# Altium project Mixed Signal Board Project.PrjPcb (part 1 of 2)
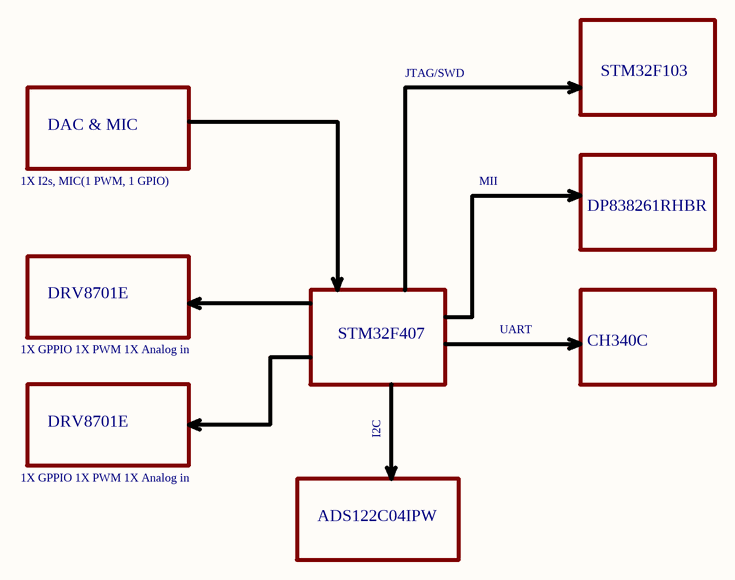
[diagram p0: [1]- Schematic Block.SchDoc]
11 sheets, 189 parts. Net scope: flat (ports and power ports of the same name join across sheets).
Board file: Mixed Signal Board Project.PcbDoc
Sheets:
  [1]- Schematic Block.SchDoc
  [2]- Power Budget.SchDoc
  [3]- STM32F103 Debugger.SchDoc
  [4]- Ethernet PHY.SchDoc
  [5]- Motor Driver Schematic.SchDoc
  [6]-CH340C.SchDoc
  [7]- ADC Chip.SchDoc
  [8]-DAC and MIC.SchDoc
  [9]-STM32F407 Controller.SchDoc
  [10]-Motor Driver-2.SchDoc
  [11]- Power Input and Regulators.SchDoc

## Sheet [1]- Schematic Block.SchDoc
size A4; DocumentNumber: 1; SheetNumber: 1; SheetTotal: 11

### Notes on the sheet
- DAC & MIC
- JTAG/SWD
- STM32F103
- 1X I2s, MIC(1 PWM, 1 GPIO)
- MII
- DP838261RHBR
- DRV8701E
- STM32F407
- UART
- 1X GPPIO 1X PWM 1X Analog in
- CH340C
- I2C
- ADS122C04IPW

## Sheet [2]- Power Budget.SchDoc
size A4; DocumentNumber: 2; SheetNumber: 2; SheetTotal: 11
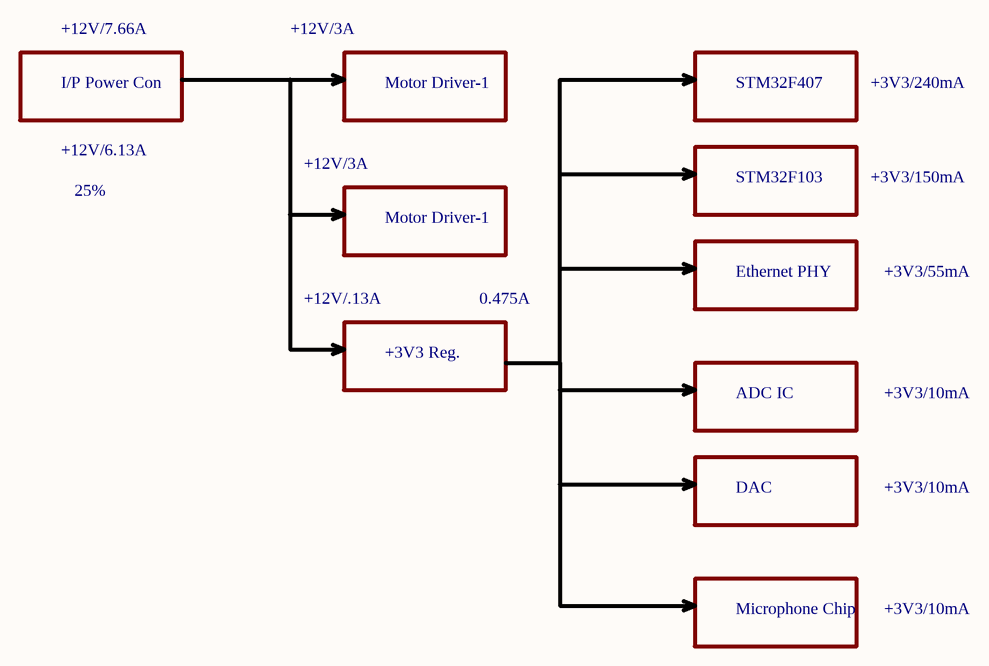
[diagram p1: [2]- Power Budget.SchDoc]

### Notes on the sheet
- +12V/7.66A
- +12V/3A
- I/P Power Con
- Motor Driver-1
- STM32F407
- +3V3/240mA
- +12V/6.13A
- 25%
- STM32F103
- +3V3/150mA
- Ethernet PHY
- +3V3/55mA
- +12V/.13A
- 0.475A
- +3V3 Reg.
- ADC IC
- +3V3/10mA
- DAC
- Microphone Chip

## Sheet [3]- STM32F103 Debugger.SchDoc
size A4; DocumentNumber: 3; SheetNumber: 3; SheetTotal: 11
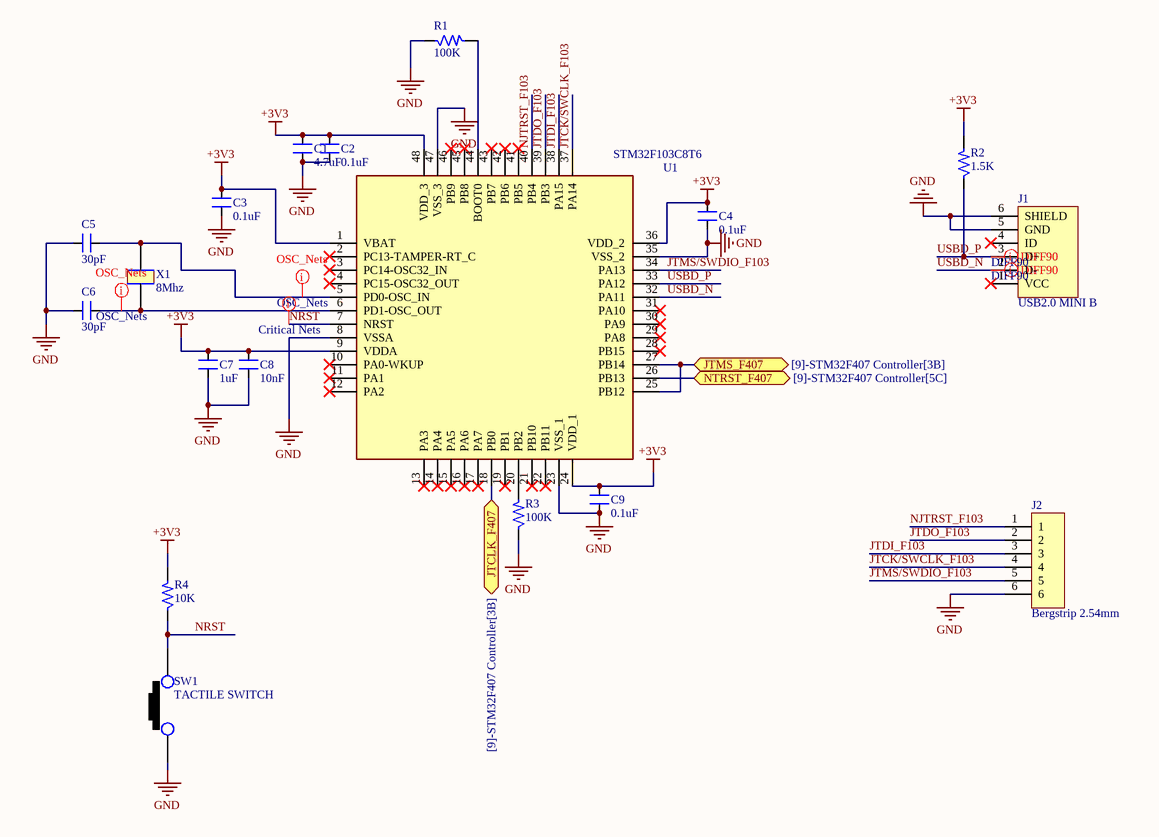
[diagram p2: [3]- STM32F103 Debugger.SchDoc]

### Parts
C1  4.7uF  [CAP_0805]
C2  0.1uF  [CAP_0805]
C3  0.1uF  [CAP_0805]
C4  0.1uF  [CAP_0805]
C5  30pF  [CAP_0805]
C6  30pF  [CAP_0805]
C7  1uF  [CAP_0805]
C8  10nF  [CAP_0805]
C9  0.1uF  [CAP_0805]
J1  USB2.0 MINI B  [CON_690-005-299-043]
J2  Bergstrip 2.54mm  [CON6_100_59D78_TH_ST]
R1  100K  [RES_0603]
R2  1.5K  [RES_0805]
R3  100K  [RES_0603]
R4  10K  [RES_0603]
SW1  TACTILE SWITCH  [SW_342_SMD]
U1  STM32F103C8T6  [LQFP-48_19.6_393_58X11_SMD]
X1  8Mhz  [XTAL_314_240X47_SMD]

### Ports
JTCLK_F407 (bidir, see [9]-STM32F407 Controller[3B]), JTMS_F407 (bidir, see [9]-STM32F407 Controller[3B]), NTRST_F407 (bidir, see [9]-STM32F407 Controller[5C])

### Nets
+3V3: C1.2 C2.1 C3.2 C4.1 C7.2 C8.2 C9.2 R2.2 R4.2 U1.1(VBAT) U1.9(VDDA) U1.24(VDD_1) U1.36(VDD_2) U1.48(VDD_3)
GND: C1.1 C2.2 C3.1 C4.2 C5.1 C6.1 C7.1 C8.1 C9.1 J1.5(GND) J1.6(SHIELD) J2.6 R1.1 R3.1 SW1.1 U1.8(VSSA) U1.23(VSS_1) U1.35(VSS_2) U1.47(VSS_3)
JTCK/SWCLK_F103: J2.4 U1.37(PA14)
JTCLK_F407: U1.18(PB0) ; port JTCLK_F407
JTDI_F103: J2.3 U1.38(PA15)
JTDO_F103: J2.2 U1.39(PB3)
JTMS/SWDIO_F103: J2.5 U1.34(PA13)
JTMS_F407: U1.25(PB12) U1.27(PB14) ; port JTMS_F407
NJTRST_F103: J2.1 U1.40(PB4)
NRST: R4.1 SW1.2 U1.7(NRST)
NTRST_F407: U1.26(PB13) ; port NTRST_F407
USBD_N: J1.2(D-) U1.32(PA11)
USBD_P: J1.3(D+) R2.1 U1.33(PA12)
NetC5_2: C5.2 U1.5(PD0-OSC_IN) X1.2
NetC6_2: C6.2 U1.6(PD1-OSC_OUT) X1.1
NetR1_2: R1.2 U1.44(BOOT0)
NetR3_2: R3.2 U1.20(PB2)

Not connected (* = marked no-connect by the designer): J1 1(VCC)* 4(ID)*; U1 2(PC13-TAMPER-RT_C)* 3(PC14-OSC32_IN)* 4(PC15-OSC32_OUT)* 10(PA0-WKUP)* 11(PA1)* 12(PA2)* 13(PA3)* 14(PA4)* 15(PA5)* 16(PA6)* 17(PA7)* 19(PB1)* 21(PB10)* 22(PB11)* 28(PB15)* 29(PA8)* 30(PA9)* 31(PA10)* 41(PB5)* 42(PB6)* 43(PB7)* 45(PB8)* 46(PB9)*

### Layout directives
differential pair; differential pair class DIFF90: USBD_N, USBD_P
net class OSC_Nets: NetC5_2, NetC6_2
net class Critical Nets: NRST

### Library data of the parts
C1 = CAP_4.7uF-50V-10%-0805: 4.7µF ±10% 50V Ceramic Capacitor X5R 0805 (2012 Metric); Manufacturer: Yageo; Manufacturer Part Number: GRM21BR61H475KE51L; Alternate Part Number-1: NA; Case/Package: 0805; Supplier-1: SIRICOM; Supplier Part Number-1: CL21A475KBQNNNE
C2-C4 C9 = CAP_0.1uF-50V-10%-0805: 0.1µF ±10% 50V Ceramic Capacitor X7R 0805 (2012 Metric); Manufacturer: Samsung; Manufacturer Part Number: CL21B104KBCNNNC; Alternate Part Number-1: NA; Case/Package: 0805; Supplier-1: SIRICOM; Supplier Part Number-1: 0805B104K500CT
C5 C6 = CAP_30pF-50V-10%-0805: ±10% 50V Ceramic Capacitor C0G, NP0 0805 (2012 Metric); Manufacturer Part Number: C0805C300K5GAC7800; Manufacturer: KEMET; Alternate Part Number: NA; Case/Package: 0805; Supplier-1: Digikey; Supplier Part Number-1: 399-17443-1-ND - Cut Tape (CT)
C7 = CAP_1uF-50V-5%-0805: 1µF ±5% 50V Ceramic Capacitor X7R 0805 (2012 Metric); Manufacturer: Samsung; Manufacturer Part Number: CC0805JKX7R9BB105; Alternate Part Number-1: 0805F105M500NT; Case/Package: 0805; Supplier-1: SIRICOM; Supplier Part Number-1: CL21B105KBFNNNE
C8 = CAP_10nF-50V-10%-0805: 10000pF ±10% 50V Ceramic Capacitor X7R 0805 (2012 Metric); Manufacturer: Samsung; Manufacturer Part Number: C0805C103K5RECAUTO; Alternate Part Number-1: GRM2195C1H103JA01D; Case/Package: 0805; Supplier-1: SIRICOM; Supplier Part Number-1: 0805B103K500CT
J1 = CON_USB2.0-MINIB-SMD: USB - mini B USB 2.0 Receptacle Connector 5 Position Surface Mount, Right Angle; Manufacturer: EDAC; Manufacturer Part Number: 690-005-299-043; Alternate Part Number-1: NA; Case/Package: USB-MINI-B; Supplier-1: LCSC; Supplier Part Number-1: C105424
J2 = CON-BS-SKT_6X1-100-ST-TH: 6 Pins, 1 Row 2.54mm Pitch, Straight bergstrip, Female; Manufacturer: Molex; Alternate Part Number-1: NA; Manufacturer Part Number: 22-10-2061; Case/Package: TH-CON; Supplier-1: SP ROAD; Supplier Part Number-1: NA
R1 R3 = RES_100K-0.1W-1%-0603: 100 kOhms ±1% 0.1W, 1/10W Chip Resistor 0603 (1608 Metric) Automotive AEC-Q200 Thick Film; Manufacturer: Stackpole Electronics; Manufacturer Part Number: RMCF0603FT100K; Alternate Part Number-1: NA; Case/Package: 0603; Supplier-1: Arrow; Supplier Part Number-1: RMCF0603FT100K
R2 = RES_1.5K-0.125W-1%-0805: 1.5 kOhms ±1% 0.125W, 1/8W Chip Resistor 0805 (2012 Metric) Thick Film; Manufacturer: TE Connectivity Passive Product; Manufacturer Part Number: CRG0805F1K5; Alternate Part Number-1: NA; Case/Package: 0805; Supplier-1: SIRICOM; Supplier Part Number-1: NA
R4 = RES_10K-0.1W-1%-0603: 10 kOhms ±1% 0.1W, 1/10W Chip Resistor 0603 (1608 Metric) Automotive AEC-Q200 Thick Film; Manufacturer: Walsin; Manufacturer Part Number: WR06X1002FTL; Alternate Part Number-1: 0603WAJ0103T5E; Case/Package: 0603; Supplier-1: SIRICOM; Supplier Part Number-1: WR06X1002FTL
SW1 = SW1_RS-282G05A3-SMRT-SMD: Tactile Switch SPST-NO Top Actuated Surface Mount; Manufacturer: ITT C&K; Alternate Part Number-1: NA; Manufacturer Part Number: RS-282G05A3-SMRT; Case/Package: SMD; Supplier-1: SP ROAD; Supplier Part Number-1: RS-282G05A3-SMRT
U1 = IC_STM32F103C8T6: ARM® Cortex®-M3 STM32F1 Microcontroller IC 32-Bit 72MHz 64KB (64K x 8) FLASH 48-LQFP (7x7); Manufacturer: STMicroelectronics; Alternate Part Number-1: NA; Manufacturer Part Number: STM32F103C8T6; Case/Package: LQFP48; Supplier-1: LCSC; Supplier Part Number-1: STM32F103C8T6
X1 = XTAL_8MHZ-ECS-80-32-5PX-SMD: 8MHz ±30ppm Crystal 32pF 60 Ohms HC-49/US; Manufacturer: Fox Electronics; Manufacturer Part Number: ECS-80-32-5PX-TR; Alternate Part Number-1: NA; Case/Package: SMD/SMT; Supplier-1: SP ROAD; Supplier Part Number-1: ECS-80-32-5PX-TR

## Sheet [4]- Ethernet PHY.SchDoc
size A4; DocumentNumber: 4; SheetNumber: 4; SheetTotal: 11
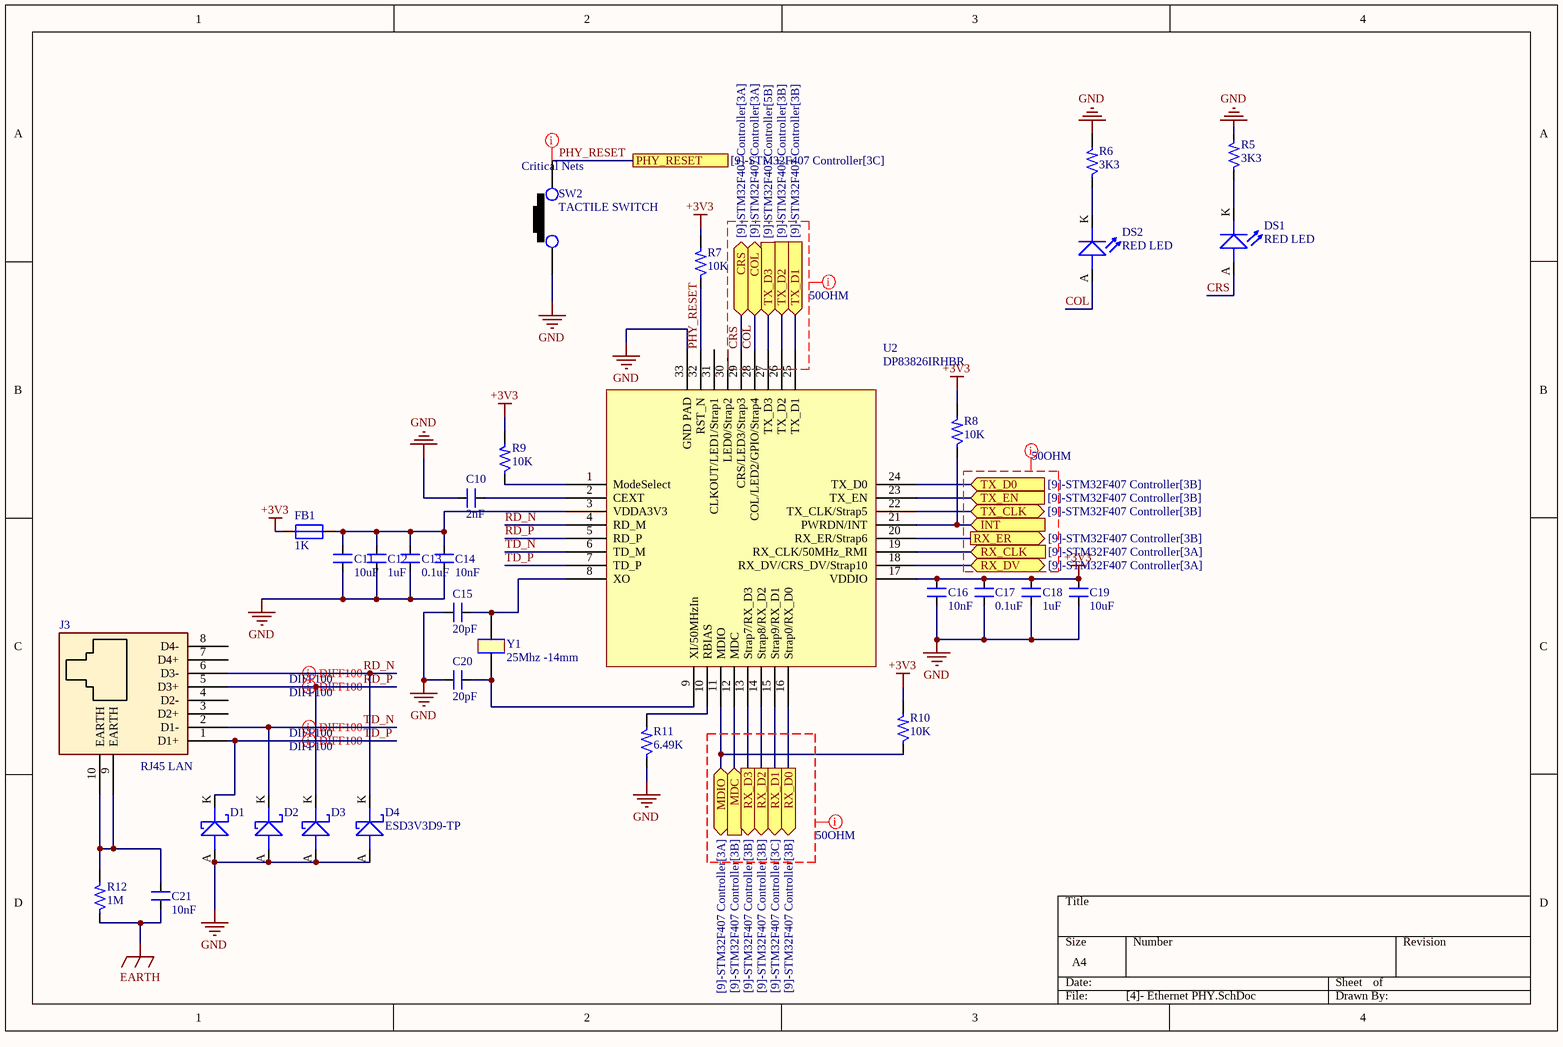
[diagram p3: [4]- Ethernet PHY.SchDoc]

### Parts
C10  2nF  [CAP_0805]
C11  10uF  [CAP_1206]
C12  1uF  [CAP_0805]
C13  0.1uF  [CAP_0805]
C14  10nF  [CAP_0805]
C15  20pF  [CAP_0805]
C16  10nF  [CAP_0805]
C17  0.1uF  [CAP_0805]
C18  1uF  [CAP_0805]
C19  10uF  [CAP_1206]
C20  20pF  [CAP_0805]
C21  10nF  [CAP_P196_102X287_H332_RAD_TH]
D1  ESD3V3D9-TP  [DIO_SOD-923]  (value not drawn)
D2  ESD3V3D9-TP  [DIO_SOD-923]  (value not drawn)
D3  ESD3V3D9-TP  [DIO_SOD-923]  (value not drawn)
D4  ESD3V3D9-TP  [DIO_SOD-923]
DS1  RED LED  [LED_0805]
DS2  RED LED  [LED_0805]
FB1  1K  [IND_0805]
J3  RJ45 LAN  [CON10_P106_RJ45_TH_ST]
R5  3K3  [RES_0603]
R6  3K3  [RES_0603]
R7  10K  [RES_0603]
R8  10K  [RES_0603]
R9  10K  [RES_0603]
R10  10K  [RES_0603]
R11  6.49K  [RES_0805]
R12  1M  [RES_1206]
SW2  TACTILE SWITCH  [SW_342_SMD]
U2  DP83826IRHBR  [VQFN32_19_218_23X9_SMD]
Y1  25Mhz -14mm  [XTAL_314_240X47_SMD]

### Ports
COL (bidir, see [9]-STM32F407 Controller[3A]), CRS (bidir, see [9]-STM32F407 Controller[3A]), INT (in), MDC (in, see [9]-STM32F407 Controller[3B]), MDIO (bidir, see [9]-STM32F407 Controller[3A]), PHY_RESET (see [9]-STM32F407 Controller[3C]), RX_CLK (in, see [9]-STM32F407 Controller[3A]), RX_D0 (out, see [9]-STM32F407 Controller[3B]), RX_D1 (out, see [9]-STM32F407 Controller[3C]), RX_D2 (out, see [9]-STM32F407 Controller[3B]), RX_D3 (out, see [9]-STM32F407 Controller[3B]), RX_DV (bidir, see [9]-STM32F407 Controller[3A]), RX_ER (out, see [9]-STM32F407 Controller[3B]), TX_CLK (bidir, see [9]-STM32F407 Controller[3B]), TX_D0 (in, see [9]-STM32F407 Controller[3B]), TX_D1 (in, see [9]-STM32F407 Controller[3B]), TX_D2 (in, see [9]-STM32F407 Controller[3B]), TX_D3 (in, see [9]-STM32F407 Controller[5B]), TX_EN (in, see [9]-STM32F407 Controller[3B])

### Nets
+3V3: C16.2 C17.2 C18.2 C19.2 FB1.1 R7.2 R8.2 R9.2 R10.2 U2.17(VDDIO)
EARTH: C21.2 R12.1
GND: C10.1 C11.1 C12.1 C13.1 C14.1 C15.1 C16.1 C17.1 C18.1 C19.1 C20.1 D1.A D2.A D3.A D4.A R5.2 R6.2 R11.1 SW2.1 U2.33(GND_PAD)
COL: DS2.A(ANODE) U2.28(COL/LED2/GPIO/Strap4) ; port COL
CRS: DS1.A(ANODE) U2.29(CRS/LED3/Strap3) ; port CRS
INT: R8.1 U2.21(PWRDN/INT) ; port INT
MDC: U2.12(MDC) ; port MDC
MDIO: R10.1 U2.11(MDIO) ; port MDIO
PHY_RESET: R7.1 SW2.2 U2.32(RST_N) ; port PHY_RESET
RD_N: D4.K J3.6(D3-) U2.4(RD_M)
RD_P: D3.K J3.5(D3+) U2.5(RD_P)
RX_CLK: U2.19(RX_CLK/50MHz_RMI) ; port RX_CLK
RX_D0: U2.16(Strap0/RX_D0) ; port RX_D0
RX_D1: U2.15(Strap9/RX_D1) ; port RX_D1
RX_D2: U2.14(Strap8/RX_D2) ; port RX_D2
RX_D3: U2.13(Strap7/RX_D3) ; port RX_D3
RX_DV: U2.18(RX_DV/CRS_DV/Strap10) ; port RX_DV
RX_ER: U2.20(RX_ER/Strap6) ; port RX_ER
TD_N: D2.K J3.2(D1-) U2.6(TD_M)
TD_P: D1.K J3.1(D1+) U2.7(TD_P)
TX_CLK: U2.22(TX_CLK/Strap5) ; port TX_CLK
TX_D0: U2.24(TX_D0) ; port TX_D0
TX_D1: U2.25(TX_D1) ; port TX_D1
TX_D2: U2.26(TX_D2) ; port TX_D2
TX_D3: U2.27(TX_D3) ; port TX_D3
TX_EN: U2.23(TX_EN) ; port TX_EN
NetC10_2: C10.2 U2.2(CEXT)
NetC11_2: C11.2 C12.2 C13.2 C14.2 FB1.2 U2.3(VDDA3V3)
NetC15_2: C15.2 U2.8(XO) Y1.2
NetC20_2: C20.2 U2.9(XI/50MHzIn) Y1.1
NetC21_1: C21.1 J3.9(EARTH) J3.10(EARTH) R12.2
NetDS1_K: DS1.K(CATHODE) R5.1
NetDS2_K: DS2.K(CATHODE) R6.1
NetR9_1: R9.1 U2.1(ModeSelect)
NetR11_2: R11.2 U2.10(RBIAS)

Not connected (* = marked no-connect by the designer): J3 3(D2+) 4(D2-) 7(D4+) 8(D4-); U2 30(LED0/Strap2) 31(CLKOUT/LED1/Strap1)

### Layout directives
differential pair; differential pair class DIFF100: RD_N, RD_P, TD_N, TD_P
net class 50OHM: (no net found under the mark), COL, CRS
net class Critical Nets: PHY_RESET

### Library data of the parts
C10 = CAP_2nF-50V-10%-0805: 2000pF ±10% 50V Ceramic Capacitor X7R 0805 (2012 Metric); Manufacturer: Samsung Electro-Mechanics; Manufacturer Part Number: CL21B202KBANNNC; Alternate Part Number-1: NA; Case/Package: 0805; Supplier-1: Digikey; Supplier Part Number-1: 1276-2471-1-ND - Cut Tape (CT)
C11 C19 = CAP_10uF-50V-10%-1206: 10µF ±10% 50V Ceramic Capacitor X7R 1206 (3216 Metric); Manufacturer: KEMET; Manufacturer Part Number: CL31B106KBHNNNE; Alternate Part Number-1: GRT31CR61H106ME01L; Case/Package: 1206; Supplier-1: SIRICOM; Supplier Part Number-1: CC1206KKX5R9BB106
C12 C18 = CAP_1uF-50V-5%-0805: as C7 on sheet [3]- STM32F103 Debugger; Case/Package: 0805; Supplier-1: SIRICOM; Supplier Part Number-1: CL21B105KBFNNNE
C13 C17 = CAP_0.1uF-50V-10%-0805: as C2 on sheet [3]- STM32F103 Debugger; Case/Package: 0805; Supplier-1: SIRICOM; Supplier Part Number-1: 0805B104K500CT
C14 C16 = CAP_10nF-50V-10%-0805: as C8 on sheet [3]- STM32F103 Debugger; Case/Package: 0805; Supplier-1: SIRICOM; Supplier Part Number-1: 0805B103K500CT
C15 C20 = CAP_20pF-50V-10%-0805: ±10% 50V Ceramic Capacitor C0G, NP0 0805 (2012 Metric); Manufacturer: AVX Corporation; Manufacturer Part Number: 08055A200KAT2A; Alternate Part Number-1: NA; Case/Package: 0805; Supplier-1: Digikey; Supplier Part Number-1: 478-11887-1-ND - Cut Tape (CT)
C21 = CAP_10nF-1KV-10%-RAD-TH: 10000pF ±10% 1000V (1kV) Ceramic Capacitor X7R Radial; Manufacturer: Yageo; Manufacturer Part Number: RDER73A103K2K1H03B; Alternate Part Number-1: NA; Case/Package: TH; Supplier-1: SP ROAD; Supplier Part Number-1: RDER73A103K2K1H03B
D1-D4 = DIO-T_3.3V-8.8V-SOD923: 8.8V Clamp 5A (8/20µs) Ipp Tvs Diode Surface Mount SOD-923; Manufacturer: Micro Commercial Co; Alternate Part Number-1: NA; Manufacturer Part Number: ESD3V3D9-TP; Case/Package: SOD923; Supplier-1: Digikey; Supplier Part Number-1: ESD3V3D9-TPMSCT-ND - Cut Tape (CT)
DS1 DS2 = LED_RED-2V-20mA-0805: Red 631nm LED Indication - Discrete 2V 0805 (2012 Metric); Manufacturer: Vishay Lite-On; Manufacturer Part Number: LTST-C171KRKT; Alternate Part Number-1: NA; Case/Package: 0805; Supplier-1: SP ROAD; Supplier Part Number-1: LTST-C171KRKT
FB1 = FB_1K-100MHZ-1.6A-0805: 1 kOhms @ 100MHz 1 Power Line Ferrite Bead 0805 (2012 Metric) 1.6A; Manufacturer: Laird; Manufacturer Part Number: BLM21SP102SH1D; Alternate Part Number-1: NA; Case/Package: 0805; Supplier-1: SIRICOM; Supplier Part Number-1: ACMS201209A102
J3 = CON-SKT-RJ_8C8P-RA-TH: 8 Pins, 2 Row 2.54mm Pitch, right angle Connector, male; Manufacturer: Assmann; Manufacturer Part Number: A-2004-2-4-LPS-N-R; Alternate Part Number-1: NA; Case/Package: TH-CON; Supplier-1: SP ROAD; Supplier Part Number-1: A-2004-2-4-LPS-N-R
R5 R6 = RES_3.3K-0.1W-1%-0603: 3.3 kOhms ±1% 0.1W, 1/10W Chip Resistor 0603 (1608 Metric) Automotive AEC-Q200 Thick Film; Manufacturer: Wilson; Manufacturer Part Number: WR06X3301FTL; Alternate Part Number-1: 0603WAF3301T5E; Case/Package: 0603; Supplier-1: SIRICOM; Supplier Part Number-1: WR06X3301FTL
R7-R10 = RES_10K-0.1W-1%-0603: as R4 on sheet [3]- STM32F103 Debugger; Case/Package: 0603; Supplier-1: SIRICOM; Supplier Part Number-1: WR06X1002FTL
R11 = RES_6.49K-0.125W-1%-0805: 6.49 kOhms ±1% 0.125W, 1/8W Chip Resistor 0805 (2012 Metric) Moisture Resistant Thick Film; Manufacturer: Stackpole Electronics; Manufacturer Part Number: RC0805FR-076K49L; Alternate Part Number-1: NA; Case/Package: 0805; Supplier-1: SIRICOM; Supplier Part Number-1: WRO8X6491FTL
R12 = RES_1M-0.25W-1%-1206: 1 MOhms ±1% 0.25W, 1/4W Chip Resistor 1206 (3216 Metric) Automotive AEC-Q200, High Voltage Thick Film; Manufacturer: Walsin; Manufacturer Part Number: WR12X1004FTL; Alternate Part Number-1: NA; Case/Package: 1206; Supplier-1: SIRICOM; Supplier Part Number-1: WR12X1004FTL
SW2 = SW1_RS-282G05A3-SMRT-SMD: as SW1 on sheet [3]- STM32F103 Debugger; Manufacturer Part Number: RS-282G05A3-SMRT; Case/Package: SMD; Supplier-1: SP ROAD; Supplier Part Number-1: RS-282G05A3-SMRT
U2 = IC_DP83826IRHBR: Ethernet ICs Low latency 10/100-Mbps PHY, MII interface and enhanced mode with an industrial temperature range 32-VQFN -40 to 85; Manufacturer: Texas Instruments; Alternate Part Number-1: NA; Manufacturer Part Number: DP83826IRHBR; Case/Package: 32-VQFN; Supplier-1: Mouser; Supplier Part Number-1: 595-DP83826IRHBR
Y1 = XTAL_25Mhz-FOXSDLF/250F-20: 25MHz ±30ppm Crystal 20pF 30 Ohms HC-49/US; Manufacturer: Abracon; Alternate Part Number-1: NA; Manufacturer Part Number: FOXSDLF/250F-20; Case/Package: SMD; Supplier-1: MOUSER; Supplier Part Number-1: FOXSDLF/250F-20

## Sheet [5]- Motor Driver Schematic.SchDoc
size A4; DocumentNumber: 5; SheetNumber: 5; SheetTotal: 11
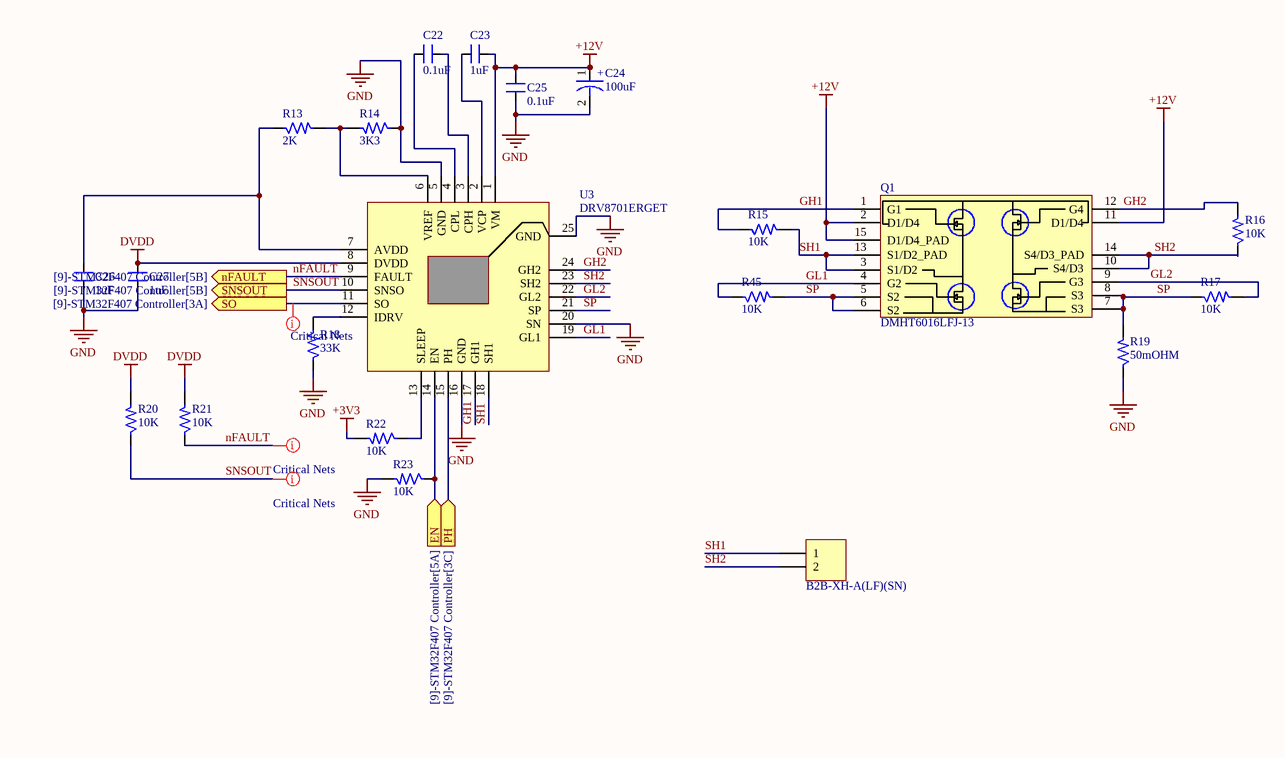
[diagram p4: [5]- Motor Driver Schematic.SchDoc]

### Parts
?  B2B-XH-A(LF)(SN)  [CON2_100_B2B-XH-A_TH_ST]
C22  0.1uF  [CAP_0805]
C23  1uF  [CAP_0805]
C24  100uF  [ACAP_P236_D305_H303_RAD]
C25  0.1uF  [CAP_0805]
C26  1uF  [CAP_0805]
C27  1uF  [CAP_0805]
Q1  DMHT6016LFJ-13  [DFN5045-12_33_212_27X15_SMD_1]
R13  2K  [RES_0603]
R14  3K3  [RES_0603]
R15  10K  [RES_0603]
R16  10K  [RES_0603]
R17  10K  [RES_0603]
R18  33K  [RES_0805]
R19  50mOHM  [RES_2512]
R20  10K  [RES_0603]
R21  10K  [RES_0603]
R22  10K  [RES_0603]
R23  10K  [RES_0603]
R45  10K  [RES_0603]
U3  DRV8701ERGET  [VFQFN24_19.6_196_12X32_SMD_1]

### Ports
EN (in, see [9]-STM32F407 Controller[5A]), nFAULT (out, see [9]-STM32F407 Controller[5B]), PH (in, see [9]-STM32F407 Controller[3C]), SNSOUT (out, see [9]-STM32F407 Controller[5B]), SO (out, see [9]-STM32F407 Controller[3A])

### Nets
+3V3: R22.2
+12V: C23.2 C24.1 C25.2 Q1.2(D1/D4) Q1.11(D1/D4) Q1.15(D1/D4_PAD) U3.1(VM)
DVDD: C27.2 R20.2 R21.2 U3.8(DVDD)
GND: C24.2 C25.1 C26.1 C27.1 R14.1 R18.1 R19.1 R23.2 U3.5(GND) U3.16(GND) U3.20(SN) U3.25(GND)
EN: R23.1 U3.14(EN) ; port EN
GH1: Q1.1(G1) R15.1 U3.17(GH1)
GH2: Q1.12(G4) R16.2 U3.24(GH2)
GL1: Q1.4(G2) R45.1 U3.19(GL1)
GL2: Q1.9(G3) R17.2 U3.22(GL2)
nFAULT: R21.1 U3.9(FAULT) ; port nFAULT
PH: U3.15(PH) ; port PH
SH1: ?.1 Q1.3(S1/D2) Q1.13(S1/D2_PAD) R15.2 U3.18(SH1)
SH2: ?.2 Q1.10(S4/D3) Q1.14(S4/D3_PAD) R16.1 U3.23(SH2)
SNSOUT: R20.1 U3.10(SNSO) ; port SNSOUT
SO: U3.11(SO) ; port SO
SP: Q1.5(S2) Q1.6(S2) Q1.7(S3) Q1.8(S3) R17.1 R19.2 R45.2 U3.21(SP)
NetC22_1: C22.1 U3.3(CPH)
NetC22_2: C22.2 U3.4(CPL)
NetC23_1: C23.1 U3.2(VCP)
NetC26_2: C26.2 R13.1 U3.7(AVDD)
NetR13_2: R13.2 R14.2 U3.6(VREF)
NetR18_2: R18.2 U3.12(IDRV)
NetR22_1: R22.1 U3.13(SLEEP)

### Layout directives
net class Critical Nets: nFAULT, SNSOUT, SO

### Notes on the sheet
- (in symbol CAP-P_100uF-25V-20%-RAD) +

### Library data of the parts
? = CON-PLG_2X1-100-ST-TH: 2 Pins, 1 Row 2.54mm Pitch, Straight Connector, male; Manufacturer: JST; Mating Part Number: XHP-2; Crimp Part Number: ASXHSXH22K51; Alternate Part Number-1: NA; Manufacturer Part Number: B2B-XH-A(LF)(SN); Case/Package: TH-CON; Supplier-1: SP ROAD; Supplier Part Number-1: B2B-XH-A(LF)(SN)
C22 C25 = CAP_0.1uF-50V-10%-0805: as C2 on sheet [3]- STM32F103 Debugger; Case/Package: 0805; Supplier-1: SIRICOM; Supplier Part Number-1: 0805B104K500CT
C23 C26 C27 = CAP_1uF-50V-5%-0805: as C7 on sheet [3]- STM32F103 Debugger; Case/Package: 0805; Supplier-1: SIRICOM; Supplier Part Number-1: CL21B105KBFNNNE
C24 = CAP-P_100uF-25V-20%-RAD: 100µF 25V Aluminum Electrolytic Capacitors Radial, Can - SMD 1000 Hrs @ 105°C; Manufacturer: Nichicon; Manufacturer Part Number: UWT1E101MCL1GS; Alternate Part Number-1: NA; Case/Package: Radial-SMD; Supplier-1: SP ROAD; Supplier Part Number-1: UWT1E101MCL1GS
Q1 = MOSFET-N_60V-14.8A-V-DFN5045-12: Mosfet Array 4 N-Channel 14.8A (Ta) Surface Mount V-DFN5045-12; Manufacturer: ON Semiconductor; Alternate Part Number-1: DMHT3006LFJ-13; Manufacturer Part Number: DMHT6016LFJ-13; Case/Package: DFN5045-12; Supplier-1: LCSC; Supplier Part Number-1: C460986
R13 = RES_2K-0.125W-1%-0603: 2 kOhms ±1% 0.125W, 1/8W Chip Resistor 0603 (1608 Metric) Anti-Sulfur, Moisture Resistant Thin Film; Manufacturer: Stackpole Electronics; Manufacturer Part Number: RNCP0603FTD2K00; Alternate Part Number-1: NA; Case/Package: 0603; Supplier-1: SIRICOM; Supplier Part Number-1: WR06X2001FTL
R14 = RES_3.3K-0.1W-1%-0603: as R5 on sheet [4]- Ethernet PHY; Case/Package: 0603; Supplier-1: SIRICOM; Supplier Part Number-1: WR06X3301FTL
R15-R17 R20-R23 R45 = RES_10K-0.1W-1%-0603: as R4 on sheet [3]- STM32F103 Debugger; Case/Package: 0603; Supplier-1: SIRICOM; Supplier Part Number-1: WR06X1002FTL
R18 = RES_33K-0.125W-1%-0805: Thick Film Resistors - SMD 33KOhms 1/8W 150V33 kOhms ±1% 0.125W, 1/8W Chip Resistor 0805 (2012 Metric) Thick Film; Manufacturer: Vishay BCcomponents; Manufacturer Part Number: CRG0805F33K; Alternate Part Number-1: NA; Case/Package: 0805; Supplier-1: SIRICOM; Supplier Part Number-1: WR08X3302FTL
R19 = RES_50mOhm-2W-1%-2512: 50 mOhms ±1% 2W Chip Resistor 2512 (6432 Metric) Automotive AEC-Q200, Current Sense, Moisture Resistant Metal Element; Manufacturer: Yageo; Manufacturer Part Number: PA2512FKF7W0R05E; Alternate Part Number-1: PMR100HZPFU5L00; Case/Package: 2512; Supplier-1: SIRICOM; Supplier Part Number-1: LR2512-22R060F1
U3 = IC_DRV8701ERGET: Motor Driver Power MOSFET Parallel 24-VQFN (4x4); Manufacturer: Texas Instruments; Alternate Part Number-1: NA; Manufacturer Part Number: DRV8701ERGET; Case/Package: VFQFN24; Supplier-1: ARROW; Supplier Part Number-1: DRV8701ERGET

## Sheet [6]-CH340C.SchDoc
size A4; DocumentNumber: 6; SheetNumber: 6; SheetTotal: 11
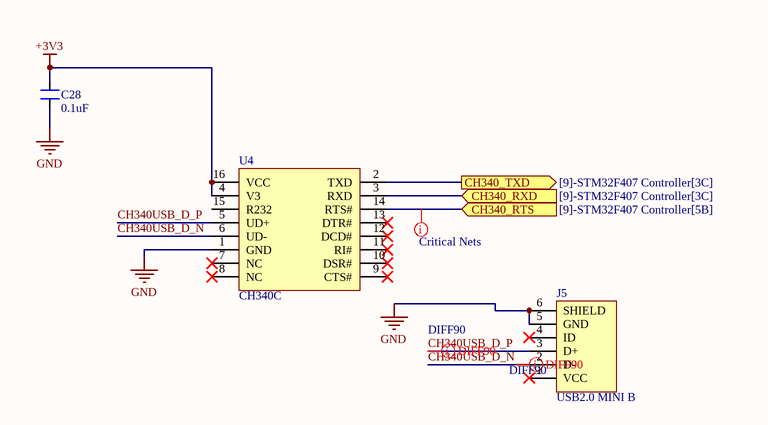
[diagram p5: [6]-CH340C.SchDoc]

### Parts
C28  0.1uF  [CAP_0805]
J5  USB2.0 MINI B  [CON_690-005-299-043]
U4  CH340C  [SOIC16_50_284_25X90_SMT]

### Ports
CH340_RTS (in, see [9]-STM32F407 Controller[5B]), CH340_RXD (in, see [9]-STM32F407 Controller[3C]), CH340_TXD (out, see [9]-STM32F407 Controller[3C])

### Nets
+3V3: C28.2 U4.4(V3) U4.16(VCC)
GND: C28.1 J5.5(GND) J5.6(SHIELD) U4.1(GND)
CH340_RTS: U4.14(RTS#) ; port CH340_RTS
CH340_RXD: U4.3(RXD) ; port CH340_RXD
CH340_TXD: U4.2(TXD) ; port CH340_TXD
CH340USB_D_N: J5.2(D-) U4.6(UD-)
CH340USB_D_P: J5.3(D+) U4.5(UD+)

Not connected (* = marked no-connect by the designer): J5 1(VCC)* 4(ID)*; U4 7(NC)* 8(NC)* 9(CTS#)* 10(DSR#)* 11(RI#)* 12(DCD#)* 13(DTR#)* 15(R232)

### Layout directives
differential pair; differential pair class DIFF90: CH340USB_D_N, CH340USB_D_P
net class Critical Nets: CH340_RTS

### Library data of the parts
C28 = CAP_0.1uF-50V-10%-0805: as C2 on sheet [3]- STM32F103 Debugger; Case/Package: 0805; Supplier-1: SIRICOM; Supplier Part Number-1: 0805B104K500CT
J5 = CON_USB2.0-MINIB-SMD: as J1 on sheet [3]- STM32F103 Debugger; Case/Package: USB-MINI-B; Supplier-1: LCSC; Supplier Part Number-1: C105424
U4 = IC_CH340C: USB Bridge, USB to UART USB 2.0 UART Interface; Manufacturer: Olimex; Alternate Part Number-1: NA; Manufacturer Part Number: CH340C; Case/Package: SOIC16; Supplier-1: LCSC; Supplier Part Number-1: C84681

## Sheet [7]- ADC Chip.SchDoc
size A4; DocumentNumber: 7; SheetNumber: 7; SheetTotal: 11
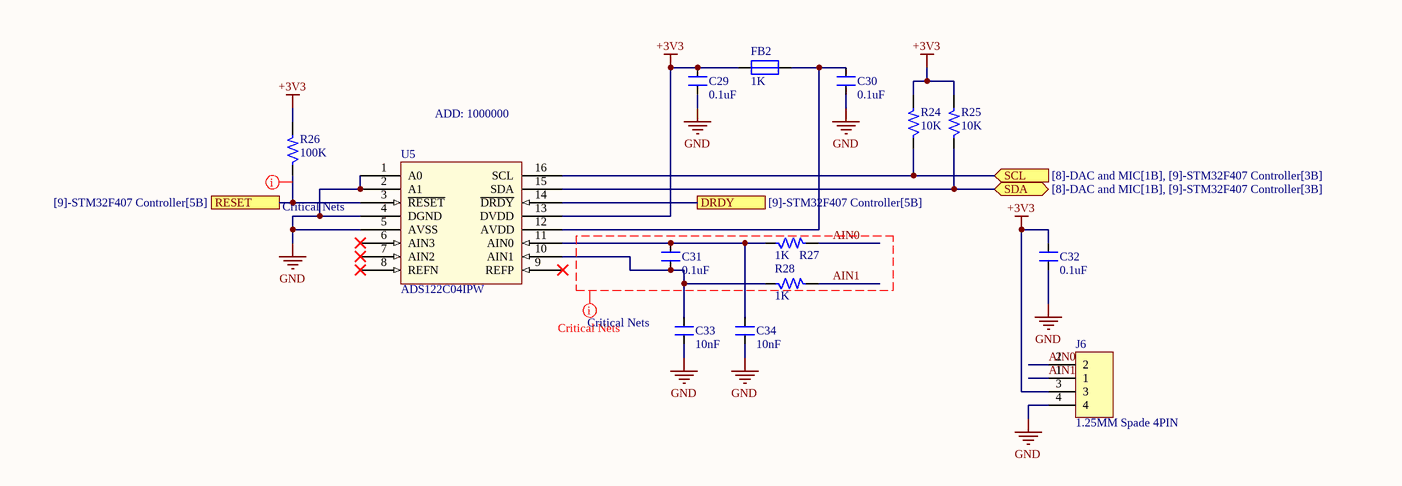
[diagram p6: [7]- ADC Chip.SchDoc]

### Parts
C29  0.1uF  [CAP_0805]
C30  0.1uF  [CAP_0805]
C31  0.1uF  [CAP_0805]
C32  0.1uF  [CAP_0805]
C33  10nF  [CAP_0805]
C34  10nF  [CAP_0805]
FB2  1K  [IND_0805]
J6  1.25MM Spade 4PIN  [CON4_50_653004117322_TH_RA]
R24  10K  [RES_0603]
R25  10K  [RES_0603]
R26  100K  [RES_0603]
R27  1K  [RES_0603]
R28  1K  [RES_0603]
U5  ADS122C04IPW  [TSSOP16_25-59_294_54X14_SMT]

### Ports
DRDY (see [9]-STM32F407 Controller[5B]), RESET (see [9]-STM32F407 Controller[5B]), SCL (in, see [8]-DAC and MIC[1B], [9]-STM32F407 Controller[3B]), SDA (bidir, see [8]-DAC and MIC[1B], [9]-STM32F407 Controller[3B])

### Nets
+3V3: C29.2 C32.2 FB2.1 J6.3 R24.2 R25.2 R26.2 U5.13(DVDD)
GND: C29.1 C30.1 C32.1 C33.1 C34.1 J6.4 U5.1(A0) U5.2(A1) U5.4(DGND) U5.5(AVSS)
AIN0: J6.2 R27.2
AIN1: J6.1 R28.2
DRDY: U5.14(~{DRDY}) ; port DRDY
RESET: R26.1 U5.3(~{RESET}) ; port RESET
SCL: R24.1 U5.16(SCL) ; port SCL
SDA: R25.1 U5.15(SDA) ; port SDA
NetC30_2: C30.2 FB2.2 U5.12(AVDD)
NetC31_1: C31.1 C33.2 R28.1 U5.10(AIN1)
NetC31_2: C31.2 C34.2 R27.1 U5.11(AIN0)

Not connected (* = marked no-connect by the designer): U5 6(AIN3)* 7(AIN2)* 8(REFN)* 9(REFP)*

### Layout directives
net class Critical Nets: AIN0, AIN1, RESET

### Notes on the sheet
- ADD: 1000000

### Library data of the parts
C29-C32 = CAP_0.1uF-50V-10%-0805: as C2 on sheet [3]- STM32F103 Debugger; Case/Package: 0805; Supplier-1: SIRICOM; Supplier Part Number-1: 0805B104K500CT
C33 C34 = CAP_10nF-50V-10%-0805: as C8 on sheet [3]- STM32F103 Debugger; Case/Package: 0805; Supplier-1: SIRICOM; Supplier Part Number-1: 0805B103K500CT
FB2 = FB_1K-100MHZ-1.6A-0805: as FB1 on sheet [4]- Ethernet PHY; Case/Package: 0805; Supplier-1: SIRICOM; Supplier Part Number-1: ACMS201209A102
J6 = CON-PLG_4X1-50-RA-TH: 4 Pins, 1 Row 1.25mm Pitch, right angle Connector, male; Manufacturer Part Number: 653004117322; Manufacturer: JST; Mating Part Number: 653004113322; Crimp Part Number: 653153128130; Alternate Part Number-1: NA; Case/Package: TH-CON; Supplier-1: WURTH; Supplier Part Number-1: 653004117322
R24 R25 = RES_10K-0.1W-1%-0603: as R4 on sheet [3]- STM32F103 Debugger; Case/Package: 0603; Supplier-1: SIRICOM; Supplier Part Number-1: WR06X1002FTL
R26 = RES_100K-0.1W-1%-0603: as R1 on sheet [3]- STM32F103 Debugger; Case/Package: 0603; Supplier-1: Arrow; Supplier Part Number-1: RMCF0603FT100K
R27 R28 = RES_1K-0.1W-1%-0603: 1 kOhms ±1% 0.1W, 1/10W Chip Resistor 0603 (1608 Metric) Automotive AEC-Q200 Thick Film; Manufacturer: Walsin; Manufacturer Part Number: WR06X1001FTL; Alternate Part Number-1: 0603WAF1001T5E; Case/Package: 0603; Supplier-1: SIRICOM; Supplier Part Number-1: WR06X1001FTL
U5 = IC_ADS122C04IPW: 24 Bit Analog to Digital Converter 4 Input 1 Sigma-Delta 16-TSSOP; Manufacturer: Texas Instruments; Alternate Part Number-1: NA; Manufacturer Part Number: ADS122C04IPW; Case/Package: TSSOP16; Supplier-1: MOUSER; Supplier Part Number-1: ADS122C04IPW

## Sheet [8]-DAC and MIC.SchDoc
size A4; DocumentNumber: 8; SheetNumber: 8; SheetTotal: 11
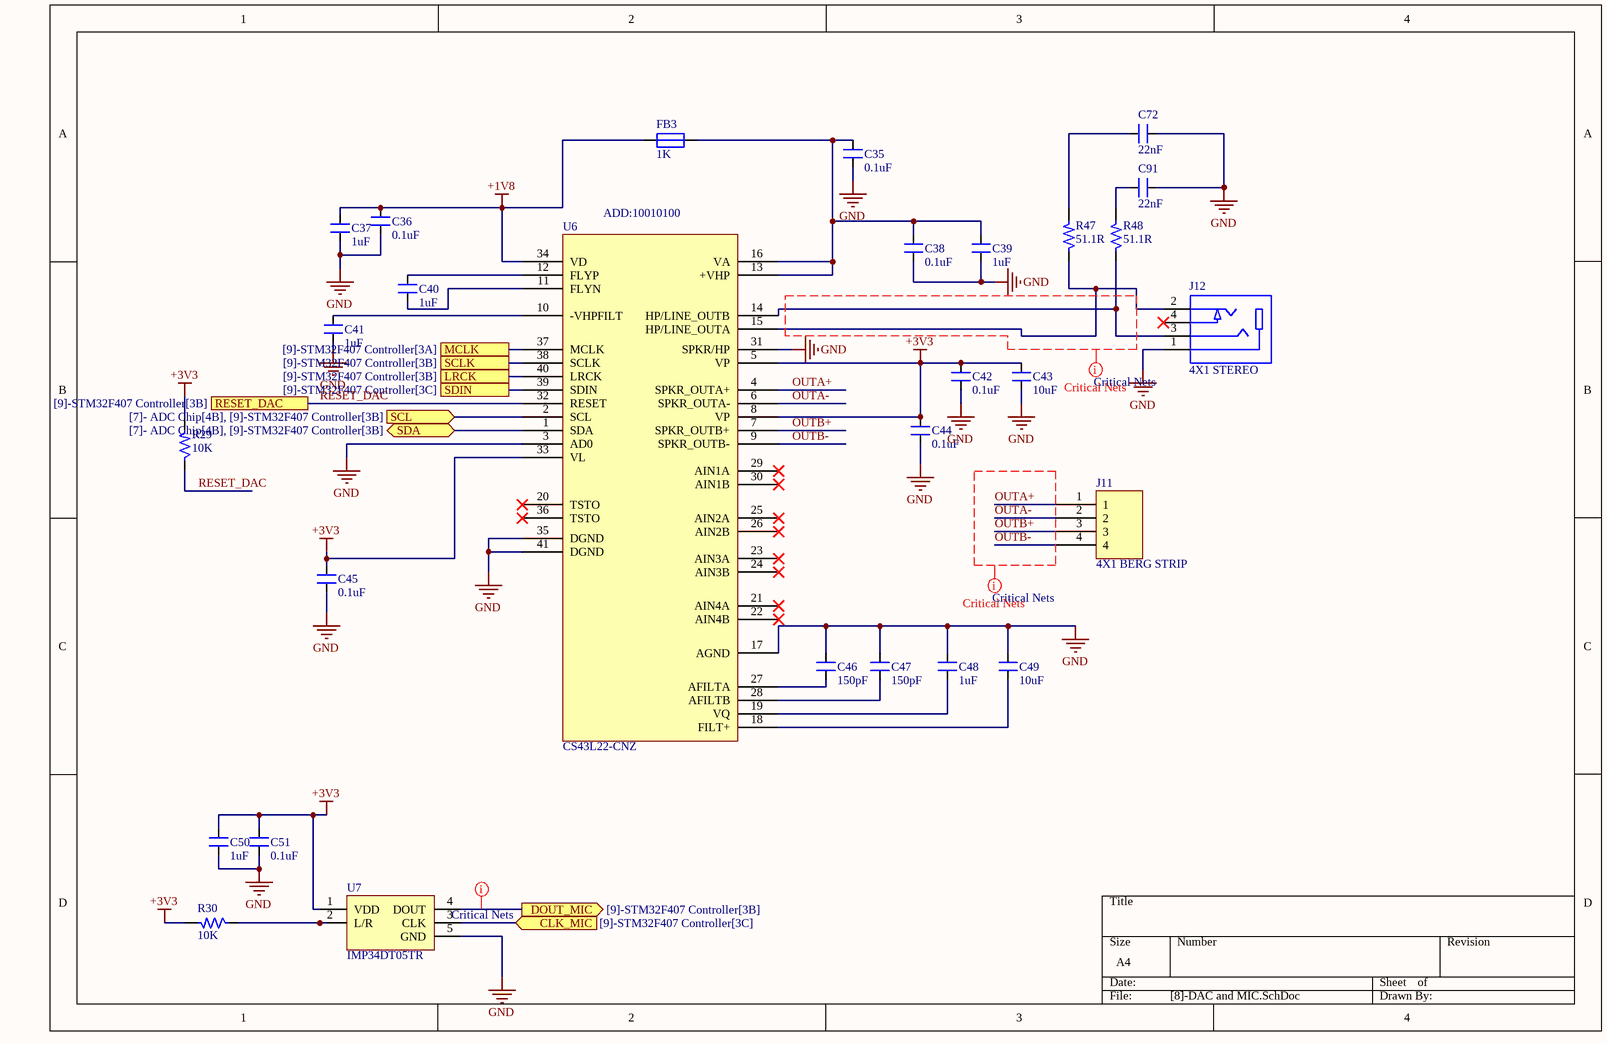
[diagram p7: [8]-DAC and MIC.SchDoc]

### Parts
(Parts that share a designator on the sheet are numbered #1, #2 ... from top to bottom, then left to right.)
C35  0.1uF  [CAP_0805]
C36  0.1uF  [CAP_0805]
C37  1uF  [CAP_0805]
C38  0.1uF  [CAP_0805]
C39  1uF  [CAP_0805]
C40  1uF  [CAP_0805]
C41  1uF  [CAP_0805]
C42  0.1uF  [CAP_0805]
C43  10uF  [CAP_1206]
C44  0.1uF  [CAP_0805]
C45  0.1uF  [CAP_0805]
C46  150pF  [CAP_0805]
C47  150pF  [CAP_0805]
C48  1uF  [CAP_0805]
C49  10uF  [CAP_1206]
C50  1uF  [CAP_0805]
C51  0.1uF  [CAP_0805]
C72#1  22nF  [CAP_0805]
C91  22nF  [CAP_0805]
FB3  1K  [IND_0805]
J11  4X1 BERG STRIP  [CON4_100_40D72_TH_ST_MALE]
J12  4X1 STEREO  [CON_SJ-2504A-SMT-TR_SMD]
R29  10K  [RES_0603]
R30  10K  [RES_0603]
R47  51.1R  [RES_0603]
R48  51.1R  [RES_0603]
U6  CS43L22-CNZ  [QFN40_19_284_33X9_SMD]
U7  IMP34DT05TR  [HCLGA-4_53_137_15X37_SMD]

### Ports
CLK_MIC (in, see [9]-STM32F407 Controller[3C]), DOUT_MIC (out, see [9]-STM32F407 Controller[3B]), LRCK (see [9]-STM32F407 Controller[3B]), MCLK (see [9]-STM32F407 Controller[3A]), RESET_DAC (see [9]-STM32F407 Controller[3B]), SCL (in, see [7]- ADC Chip[4B], [9]-STM32F407 Controller[3B]), SCLK (see [9]-STM32F407 Controller[3B]), SDA (bidir, see [7]- ADC Chip[4B], [9]-STM32F407 Controller[3B]), SDIN (see [9]-STM32F407 Controller[3C])

### Nets
+1V8: C36.2 C37.2 FB3.1 U6.34(VD)
+3V3: C42.2 C43.2 C44.2 C45.2 C50.2 C51.2 R29.2 R30.2 U6.5(VP) U6.8(VP) U6.33(VL) U7.1(VDD)
GND: C35.1 C36.1 C37.1 C38.1 C39.1 C41.1 C42.1 C43.1 C44.1 C45.1 C46.2 C47.2 C48.2 C49.2 C50.1 C51.1 C72#1.2 C91.2 J12.1 U6.3(AD0) U6.17(AGND) U6.31(SPKR/HP) U6.35(DGND) U6.41(DGND) U7.5(GND)
CLK_MIC: U7.3(CLK) ; port CLK_MIC
DOUT_MIC: U7.4(DOUT) ; port DOUT_MIC
LRCK: U6.40(LRCK) ; port LRCK
MCLK: U6.37(MCLK) ; port MCLK
OUTA+: J11.1 U6.4(SPKR_OUTA+)
OUTA-: J11.2 U6.6(SPKR_OUTA-)
OUTB+: J11.3 U6.7(SPKR_OUTB+)
OUTB-: J11.4 U6.9(SPKR_OUTB-)
RESET_DAC: R29.1 U6.32(RESET) ; port RESET_DAC
SCL: U6.2(SCL) ; port SCL
SCLK: U6.38(SCLK) ; port SCLK
SDA: U6.1(SDA) ; port SDA
SDIN: U6.39(SDIN) ; port SDIN
NetC35_2: C35.2 C38.2 C39.2 FB3.2 U6.13(+VHP) U6.16(VA)
NetC40_1: C40.1 U6.11(FLYN)
NetC40_2: C40.2 U6.12(FLYP)
NetC41_2: C41.2 U6.10(-VHPFILT)
NetC46_1: C46.1 U6.27(AFILTA)
NetC47_1: C47.1 U6.28(AFILTB)
NetC48_1: C48.1 U6.19(VQ)
NetC49_1: C49.1 U6.18(FILT+)
NetC72#1_1: C72#1.1 R47.2
NetC91_1: C91.1 R48.2
NetJ12_2: J12.2 R47.1 U6.15(HP/LINE_OUTA)
NetJ12_3: J12.3 R48.1 U6.14(HP/LINE_OUTB)
NetR30_1: R30.1 U7.2(L/R)

Not connected (* = marked no-connect by the designer): J12 4*; U6 20(TSTO)* 21(AIN4A)* 22(AIN4B)* 23(AIN3A)* 24(AIN3B)* 25(AIN2A)* 26(AIN2B)* 29(AIN1A)* 30(AIN1B)* 36(TSTO)*

### Layout directives
net class Critical Nets: DOUT_MIC, GND, OUTA+, OUTA-, OUTB+, OUTB-

### Notes on the sheet
- (near U6) ADD:10010100

### Library data of the parts
C35 C36 C38 C42 C44 C45 C51 = CAP_0.1uF-50V-10%-0805: as C2 on sheet [3]- STM32F103 Debugger; Case/Package: 0805; Supplier-1: SIRICOM; Supplier Part Number-1: 0805B104K500CT
C37 C39-C41 C48 C50 = CAP_1uF-50V-5%-0805: as C7 on sheet [3]- STM32F103 Debugger; Case/Package: 0805; Supplier-1: SIRICOM; Supplier Part Number-1: CL21B105KBFNNNE
C43 C49 = CAP_10uF-50V-10%-1206: as C11 on sheet [4]- Ethernet PHY; Case/Package: 1206; Supplier-1: SIRICOM; Supplier Part Number-1: CC1206KKX5R9BB106
C46 C47 = CAP_150pF-50V-10%-0805: 150pF ±10% 50V Ceramic Capacitor C0G, NP0 0805 (2012 Metric); Manufacturer: AVX Corporation; Manufacturer Part Number: 08055A151KAT2A; Alternate Part Number-1: NA; Case/Package: 0805; Supplier-1: Digikey; Supplier Part Number-1: 478-10501-1-ND - Cut Tape (CT)
C72#1 C91 = CAP_22nF-50V-10%-0805: 0.022µF ±10% 50V Ceramic Capacitor X7R 0805 (2012 Metric); Manufacturer: Samsung Electro-Mechanics; Manufacturer Part Number: CL21B223KBANNNC; Alternate Part Number-1: NA; Case/Package: 0805; Supplier-1: Digikey; Supplier Part Number-1: 1276-1081-1-ND - Cut Tape (CT)
FB3 = FB_1K-100MHZ-1.6A-0805: as FB1 on sheet [4]- Ethernet PHY; Case/Package: 0805; Supplier-1: SIRICOM; Supplier Part Number-1: ACMS201209A102
J11 = CON-BS-PLG_4X1-100-ST-TH: 4 Pins, 1 Row 2.54mm Pitch, Straight bergstrip, Male; Manufacturer: NA; Manufacturer Part Number: NA; Case/Package: TH-CON; Supplier-1: SP ROAD; Supplier Part Number-1: NA; Alternate Part Number-1: NA
J12 = CON-PLG-STEREO_4X1-100-RA-SMD: 2.50mm (0.094", 3/32", Sub Mini, Miniature) - Headphone Phone Jack Stereo (4 Conductor, TRRS) Connector Solder; Manufacturer: CUI Devices; Manufacturer Part Number: SJ-2504A-SMT-TR; Alternate Part Number-1: NA; Case/Package: SMD; Supplier Part Number-1: CP-SJ-2504A-SMT-CT-ND - Cut Tape (CT); Supplier-1: Digikey
R29 R30 = RES_10K-0.1W-1%-0603: as R4 on sheet [3]- STM32F103 Debugger; Case/Package: 0603; Supplier-1: SIRICOM; Supplier Part Number-1: WR06X1002FTL
R47 R48 = RES_51.1R-0.1W-1%-0603: 51.1 Ohms ±1% 0.1W, 1/10W Chip Resistor 0603 (1608 Metric) Thick Film; Manufacturer: Vishay Dale; Manufacturer Part Number: CRCW060351R1FKEAC; Alternate Part Number-1: NA; Case/Package: 0603; Supplier-1: Digikey; Supplier Part Number-1: 541-5468-1-ND - Cut Tape (CT)
U6 = IC_CS43L22: Audio D/A Converter ICs Low Power Stereo DAC w/ClassD Spkr Driver; Manufacturer: Cirrus Logic; Alternate Part Number-1: NA; Manufacturer Part Number: CS43L22-CNZ; Case/Package: QFN-40; Supplier-1: Mouser; Supplier Part Number-1: 777-CS43L22-CNZ
U7 = IC_IMP34DT05TR: MEMS Microphones AUTO & INDUSTRIAL SENSORS; Manufacturer: STMicroelectronics; Alternate Part Number-1: NA; Manufacturer Part Number: IMP34DT05TR; Case/Package: HCLGA-4; Supplier-1: Mouser; Supplier Part Number-1: 511-IMP34DT05TR

## Sheet [9]-STM32F407 Controller.SchDoc
size A3; DocumentNumber: 9; SheetNumber: 9; SheetTotal: 11
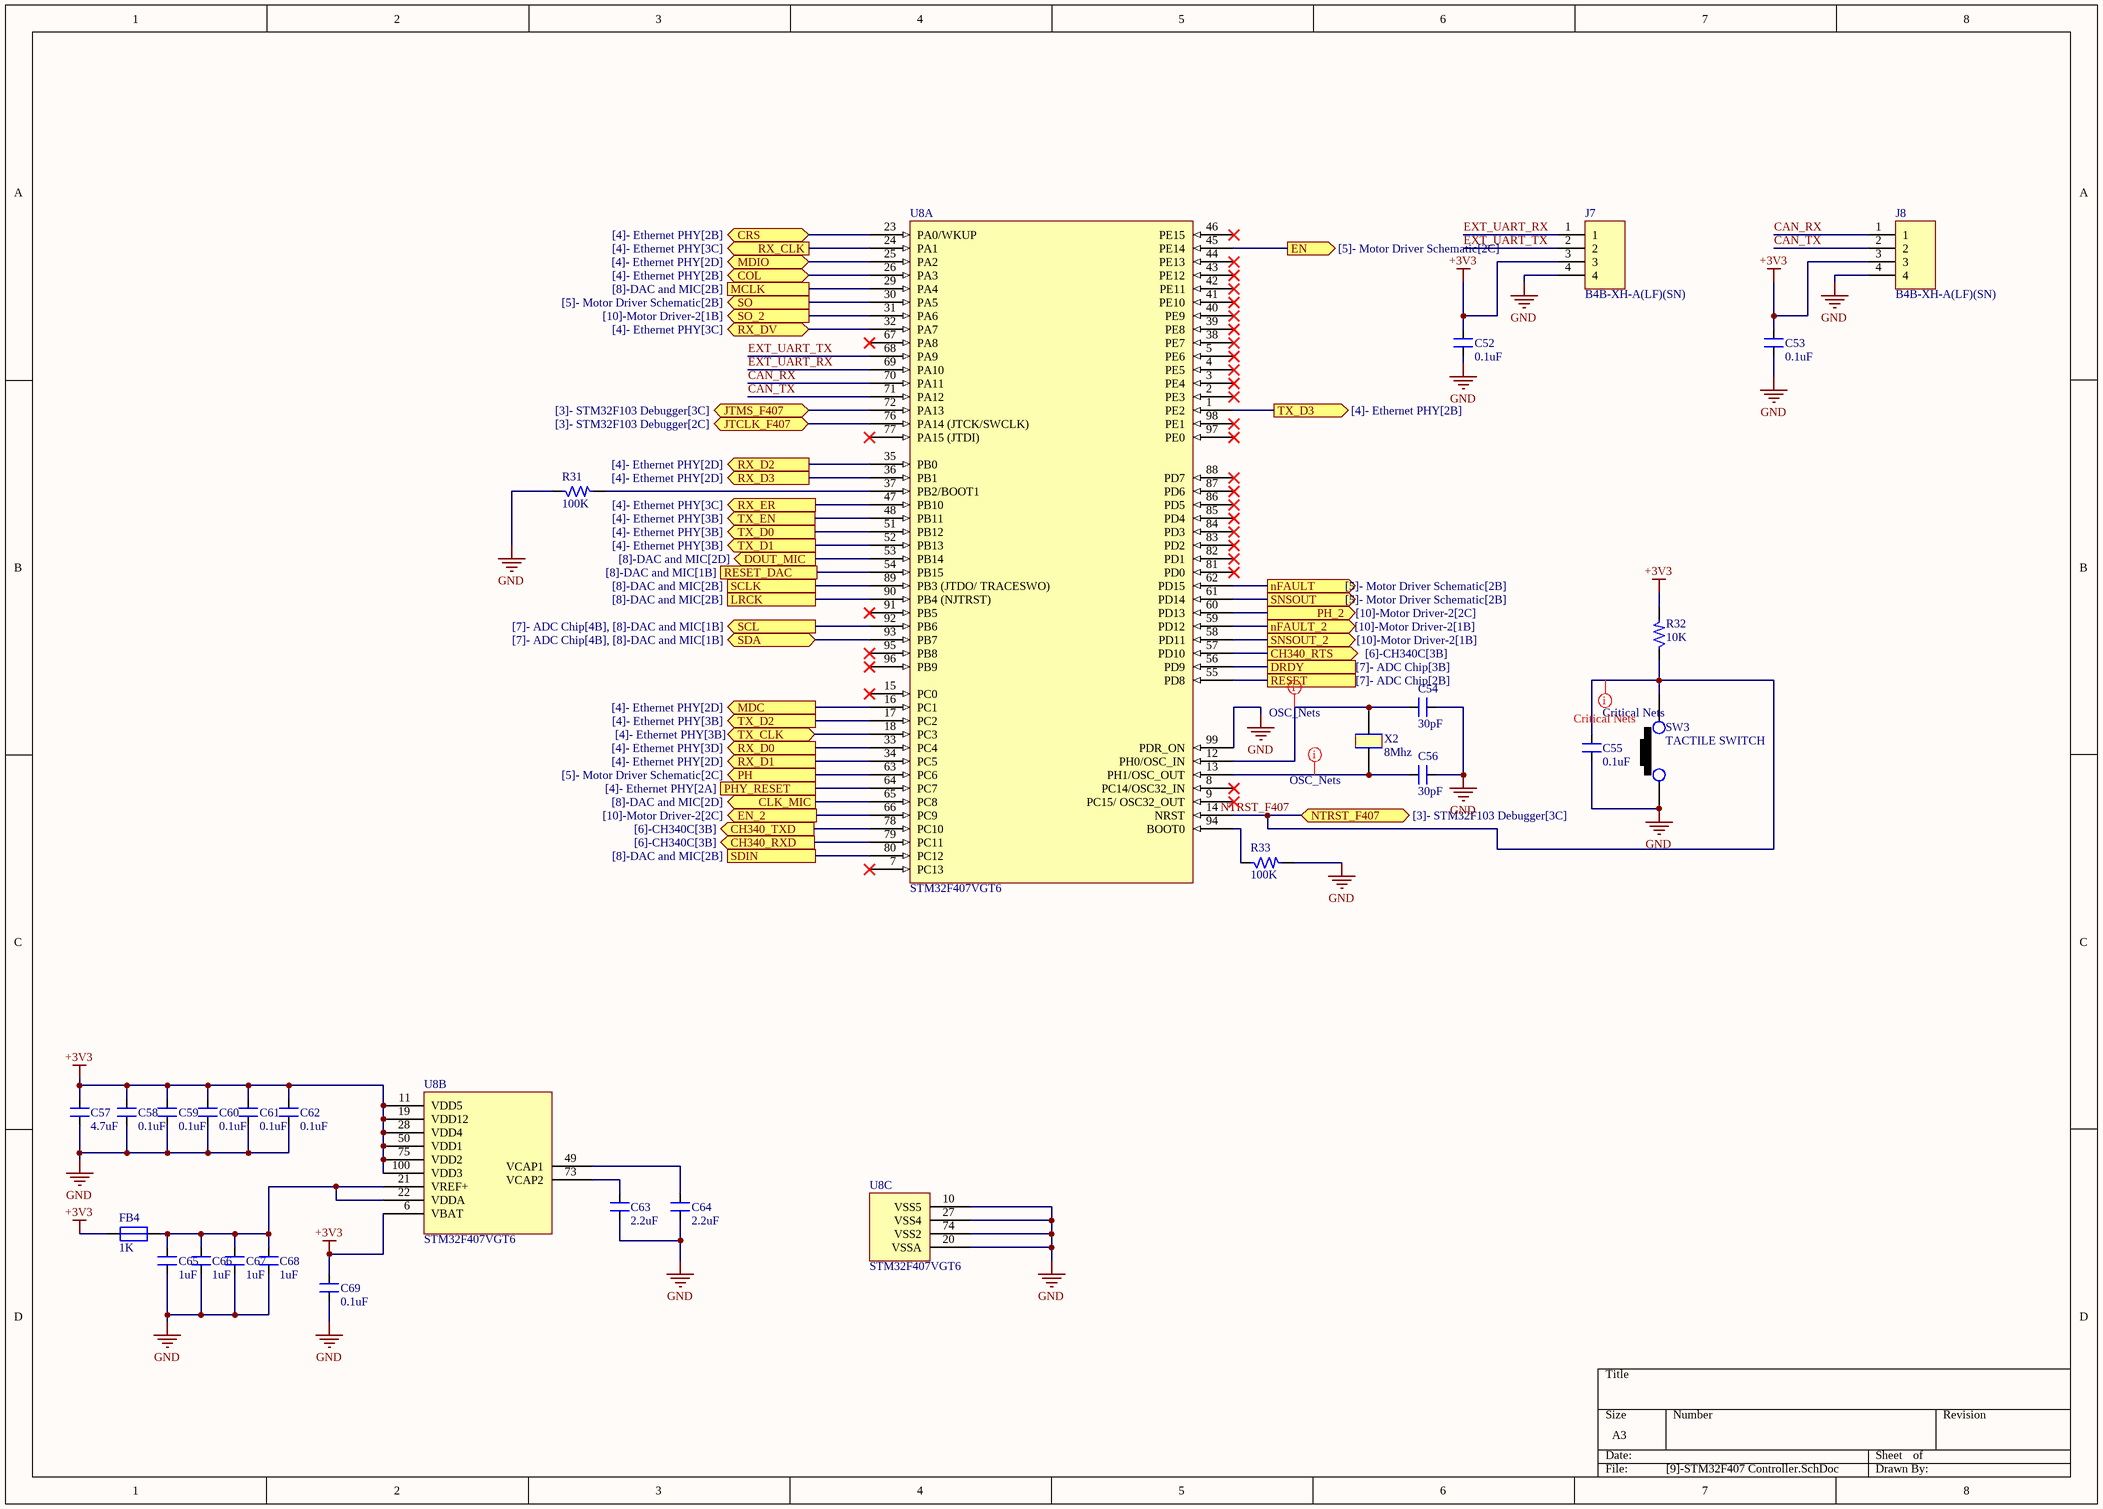
[diagram p8: [9]-STM32F407 Controller.SchDoc]

### Parts
C52  0.1uF  [CAP_0805]
C53  0.1uF  [CAP_0805]
C54  30pF  [CAP_0805]
C55  0.1uF  [CAP_0805]
C56  30pF  [CAP_0805]
C57  4.7uF  [CAP_0805]
C58  0.1uF  [CAP_0805]
C59  0.1uF  [CAP_0805]
C60  0.1uF  [CAP_0805]
C61  0.1uF  [CAP_0805]
C62  0.1uF  [CAP_0805]
C63  2.2uF  [CAP_0805]
C64  2.2uF  [CAP_0805]
C65  1uF  [CAP_0805]
C66  1uF  [CAP_0805]
C67  1uF  [CAP_0805]
C68  1uF  [CAP_0805]
C69  0.1uF  [CAP_0805]
FB4  1K  [IND_0805]
J7  B4B-XH-A(LF)(SN)  [CON4_100_B4B-XH-A_TH_ST]
J8  B4B-XH-A(LF)(SN)  [CON4_100_B4B-XH-A_TH_ST]
R31  100K  [RES_0603]
R32  10K  [RES_0603]
R33  100K  [RES_0603]
SW3  TACTILE SWITCH  [SW_342_SMD]
U8  STM32F407VGT6  [QFN100_19.6_669_58X10_SMD]  (parts A,B,C of 3)
X2  8Mhz  [XTAL_314_240X47_SMD]

### Ports
CH340_RTS (out, see [6]-CH340C[3B]), CH340_RXD (out, see [6]-CH340C[3B]), CH340_TXD (out, see [6]-CH340C[3B]), CLK_MIC (out, see [8]-DAC and MIC[2D]), COL (bidir, see [4]- Ethernet PHY[2B]), CRS (bidir, see [4]- Ethernet PHY[2B]), DOUT_MIC (out, see [8]-DAC and MIC[2D]), DRDY (see [7]- ADC Chip[3B]), EN (out, see [5]- Motor Driver Schematic[2C]), EN_2 (out, see [10]-Motor Driver-2[2C]), JTCLK_F407 (bidir, see [3]- STM32F103 Debugger[2C]), JTMS_F407 (bidir, see [3]- STM32F103 Debugger[3C]), LRCK (see [8]-DAC and MIC[2B]), MCLK (see [8]-DAC and MIC[2B]), MDC (out, see [4]- Ethernet PHY[2D]), MDIO (bidir, see [4]- Ethernet PHY[2D]), nFAULT (out, see [5]- Motor Driver Schematic[2B]), nFAULT_2 (out, see [10]-Motor Driver-2[1B]), NTRST_F407 (bidir, see [3]- STM32F103 Debugger[3C]), PH (out, see [5]- Motor Driver Schematic[2C]), PH_2 (out, see [10]-Motor Driver-2[2C]), PHY_RESET (see [4]- Ethernet PHY[2A]), RESET (see [7]- ADC Chip[2B]), RESET_DAC (see [8]-DAC and MIC[1B]), RX_CLK (out, see [4]- Ethernet PHY[3C]), RX_D0 (out, see [4]- Ethernet PHY[3D]), RX_D1 (out, see [4]- Ethernet PHY[2D]), RX_D2 (out, see [4]- Ethernet PHY[2D]), RX_D3 (out, see [4]- Ethernet PHY[2D]), RX_DV (bidir, see [4]- Ethernet PHY[3C]), RX_ER (out, see [4]- Ethernet PHY[3C]), SCL (out, see [7]- ADC Chip[4B], [8]-DAC and MIC[1B]), SCLK (see [8]-DAC and MIC[2B]), SDA (bidir, see [7]- ADC Chip[4B], [8]-DAC and MIC[1B]), SDIN (see [8]-DAC and MIC[2B]), SNSOUT (out, see [5]- Motor Driver Schematic[2B]), SNSOUT_2 (out, see [10]-Motor Driver-2[1B]), SO (out, see [5]- Motor Driver Schematic[2B]), SO_2 (out, see [10]-Motor Driver-2[1B]), TX_CLK (bidir, see [4]- Ethernet PHY[3B]), TX_D0 (out, see [4]- Ethernet PHY[3B]), TX_D1 (out, see [4]- Ethernet PHY[3B]), TX_D2 (out, see [4]- Ethernet PHY[3B]), TX_D3 (out, see [4]- Ethernet PHY[2B]), TX_EN (out, see [4]- Ethernet PHY[3B])

### Nets
+3V3: C52.2 C53.2 C57.2 C58.2 C59.2 C60.2 C61.2 C62.2 C69.1 FB4.1 J7.3 J8.3 R32.2 U8.6(VBAT) U8.11(VDD5) U8.19(VDD12) U8.28(VDD4) U8.50(VDD1) U8.75(VDD2) U8.100(VDD3)
GND: C52.1 C53.1 C54.2 C55.1 C56.2 C57.1 C58.1 C59.1 C60.1 C61.1 C62.1 C63.1 C64.1 C65.1 C66.1 C67.1 C68.1 C69.2 J7.4 J8.4 R31.1 R33.2 SW3.1 U8.10(VSS5) U8.20(VSSA) U8.27(VSS4) U8.74(VSS2) U8.99(PDR_ON)
CAN_RX: J8.1 U8.70(PA11)
CAN_TX: J8.2 U8.71(PA12)
CH340_RTS: U8.57(PD10) ; port CH340_RTS
CH340_RXD: U8.79(PC11) ; port CH340_RXD
CH340_TXD: U8.78(PC10) ; port CH340_TXD
CLK_MIC: U8.65(PC8) ; port CLK_MIC
COL: U8.26(PA3) ; port COL
CRS: U8.23(PA0/WKUP) ; port CRS
DOUT_MIC: U8.53(PB14) ; port DOUT_MIC
DRDY: U8.56(PD9) ; port DRDY
EN: U8.45(PE14) ; port EN
EN_2: U8.66(PC9) ; port EN_2
EXT_UART_RX: J7.1 U8.69(PA10)
EXT_UART_TX: J7.2 U8.68(PA9)
JTCLK_F407: U8.76(PA14_(JTCK/SWCLK)) ; port JTCLK_F407
JTMS_F407: U8.72(PA13) ; port JTMS_F407
LRCK: U8.90(PB4_(NJTRST)) ; port LRCK
MCLK: U8.29(PA4) ; port MCLK
MDC: U8.16(PC1) ; port MDC
MDIO: U8.25(PA2) ; port MDIO
nFAULT: U8.62(PD15) ; port nFAULT
nFAULT_2: U8.59(PD12) ; port nFAULT_2
NTRST_F407: C55.2 R32.1 SW3.2 U8.14(NRST) ; port NTRST_F407
PH: U8.63(PC6) ; port PH
PH_2: U8.60(PD13) ; port PH_2
PHY_RESET: U8.64(PC7) ; port PHY_RESET
RESET: U8.55(PD8) ; port RESET
RESET_DAC: U8.54(PB15) ; port RESET_DAC
RX_CLK: U8.24(PA1) ; port RX_CLK
RX_D0: U8.33(PC4) ; port RX_D0
RX_D1: U8.34(PC5) ; port RX_D1
RX_D2: U8.35(PB0) ; port RX_D2
RX_D3: U8.36(PB1) ; port RX_D3
RX_DV: U8.32(PA7) ; port RX_DV
RX_ER: U8.47(PB10) ; port RX_ER
SCL: U8.92(PB6) ; port SCL
SCLK: U8.89(PB3_(JTDO/_TRACESWO)) ; port SCLK
SDA: U8.93(PB7) ; port SDA
SDIN: U8.80(PC12) ; port SDIN
SNSOUT: U8.61(PD14) ; port SNSOUT
SNSOUT_2: U8.58(PD11) ; port SNSOUT_2
SO: U8.30(PA5) ; port SO
SO_2: U8.31(PA6) ; port SO_2
TX_CLK: U8.18(PC3) ; port TX_CLK
TX_D0: U8.51(PB12) ; port TX_D0
TX_D1: U8.52(PB13) ; port TX_D1
TX_D2: U8.17(PC2) ; port TX_D2
TX_D3: U8.1(PE2) ; port TX_D3
TX_EN: U8.48(PB11) ; port TX_EN
NetC54_1: C54.1 U8.12(PH0/OSC_IN) X2.2
NetC56_1: C56.1 U8.13(PH1/OSC_OUT) X2.1
NetC63_2: C63.2 U8.73(VCAP2)
NetC64_2: C64.2 U8.49(VCAP1)
NetC65_2: C65.2 C66.2 C67.2 C68.2 FB4.2 U8.21(VREF+) U8.22(VDDA)
NetR31_2: R31.2 U8.37(PB2/BOOT1)
NetR33_1: R33.1 U8.94(BOOT0)

Not connected (* = marked no-connect by the designer): U8 2(PE3)* 3(PE4)* 4(PE5)* 5(PE6)* 7(PC13)* 8(PC14/OSC32_IN)* 9(PC15/_OSC32_OUT)* 15(PC0)* 38(PE7)* 39(PE8)* 40(PE9)* 41(PE10)* 42(PE11)* 43(PE12)* 44(PE13)* 46(PE15)* 67(PA8)* 77(PA15_(JTDI))* 81(PD0)* 82(PD1)* 83(PD2)* 84(PD3)* 85(PD4)* 86(PD5)* 87(PD6)* 88(PD7)* 91(PB5)* 95(PB8)* 96(PB9)* 97(PE0)* 98(PE1)*

### Layout directives
net class OSC_Nets: NetC54_1, NetC56_1
net class Critical Nets: NTRST_F407

### Notes on the sheet
- Labels drawn without touching a wire or pin: NTRST_F407

### Library data of the parts
C52 C53 C55 C58-C62 C69 = CAP_0.1uF-50V-10%-0805: as C2 on sheet [3]- STM32F103 Debugger; Case/Package: 0805; Supplier-1: SIRICOM; Supplier Part Number-1: 0805B104K500CT
C54 C56 = CAP_30pF-50V-10%-0805: as C5 on sheet [3]- STM32F103 Debugger; Case/Package: 0805; Supplier-1: Digikey; Supplier Part Number-1: 399-17443-1-ND - Cut Tape (CT)
C57 = CAP_4.7uF-50V-10%-0805: as C1 on sheet [3]- STM32F103 Debugger; Case/Package: 0805; Supplier-1: SIRICOM; Supplier Part Number-1: CL21A475KBQNNNE
C63 C64 = CAP_2.2uF-25V-10%-0805: 2.2µF ±10% 25V Ceramic Capacitor X7R 0805 (2012 Metric); Manufacturer: KEMET; Manufacturer Part Number: CL21B225KAFNFNE; Alternate Part Number-1: NA; Case/Package: 0805; Supplier-1: SIRICOM; Supplier Part Number-1: CL21A225KAFNNNE
C65-C68 = CAP_1uF-50V-5%-0805: as C7 on sheet [3]- STM32F103 Debugger; Case/Package: 0805; Supplier-1: SIRICOM; Supplier Part Number-1: CL21B105KBFNNNE
FB4 = FB_1K-100MHZ-1.6A-0805: as FB1 on sheet [4]- Ethernet PHY; Case/Package: 0805; Supplier-1: SIRICOM; Supplier Part Number-1: ACMS201209A102
J7 J8 = CON-PLG_4X1-100-ST-TH: 4 Pins, 1 Row 2.54mm Pitch, straight Connector, male; Manufacturer: Wurth Electronics; Mating Part Number: XHP-4; Crimp Part Number: ASXHSXH22K51; Alternate Part Number-1: NA; Manufacturer Part Number: B4B-XH-A(LF)(SN); Case/Package: TH-CON; Supplier-1: LCSC; Supplier Part Number-1: B4B-XH-A(LF)(SN)
R31 R33 = RES_100K-0.1W-1%-0603: as R1 on sheet [3]- STM32F103 Debugger; Case/Package: 0603; Supplier-1: Arrow; Supplier Part Number-1: RMCF0603FT100K
R32 = RES_10K-0.1W-1%-0603: as R4 on sheet [3]- STM32F103 Debugger; Case/Package: 0603; Supplier-1: SIRICOM; Supplier Part Number-1: WR06X1002FTL
SW3 = SW1_RS-282G05A3-SMRT-SMD: as SW1 on sheet [3]- STM32F103 Debugger; Manufacturer Part Number: RS-282G05A3-SMRT; Case/Package: SMD; Supplier-1: SP ROAD; Supplier Part Number-1: RS-282G05A3-SMRT
U8 = IC_STM32F407VGT6: ARM® Cortex®-M4 STM32F4 Microcontroller IC 32-Bit 168MHz 1MB (1M x 8) FLASH 100-LQFP (14x14); Manufacturer: STMicroelectronics; Alternate Part Number-1: STM32F407VET6; Manufacturer Part Number: STM32F407VGT6; Case/Package: LQFP100; Supplier-1: ARROW; Supplier Part Number-1: STM32F407VGT6
X2 = XTAL_8MHZ-ECS-80-32-5PX-SMD: as X1 on sheet [3]- STM32F103 Debugger; Case/Package: SMD/SMT; Supplier-1: SP ROAD; Supplier Part Number-1: ECS-80-32-5PX-TR

## Sheet [10]-Motor Driver-2.SchDoc
size A4; DocumentNumber: 10; SheetNumber: 10; SheetTotal: 11
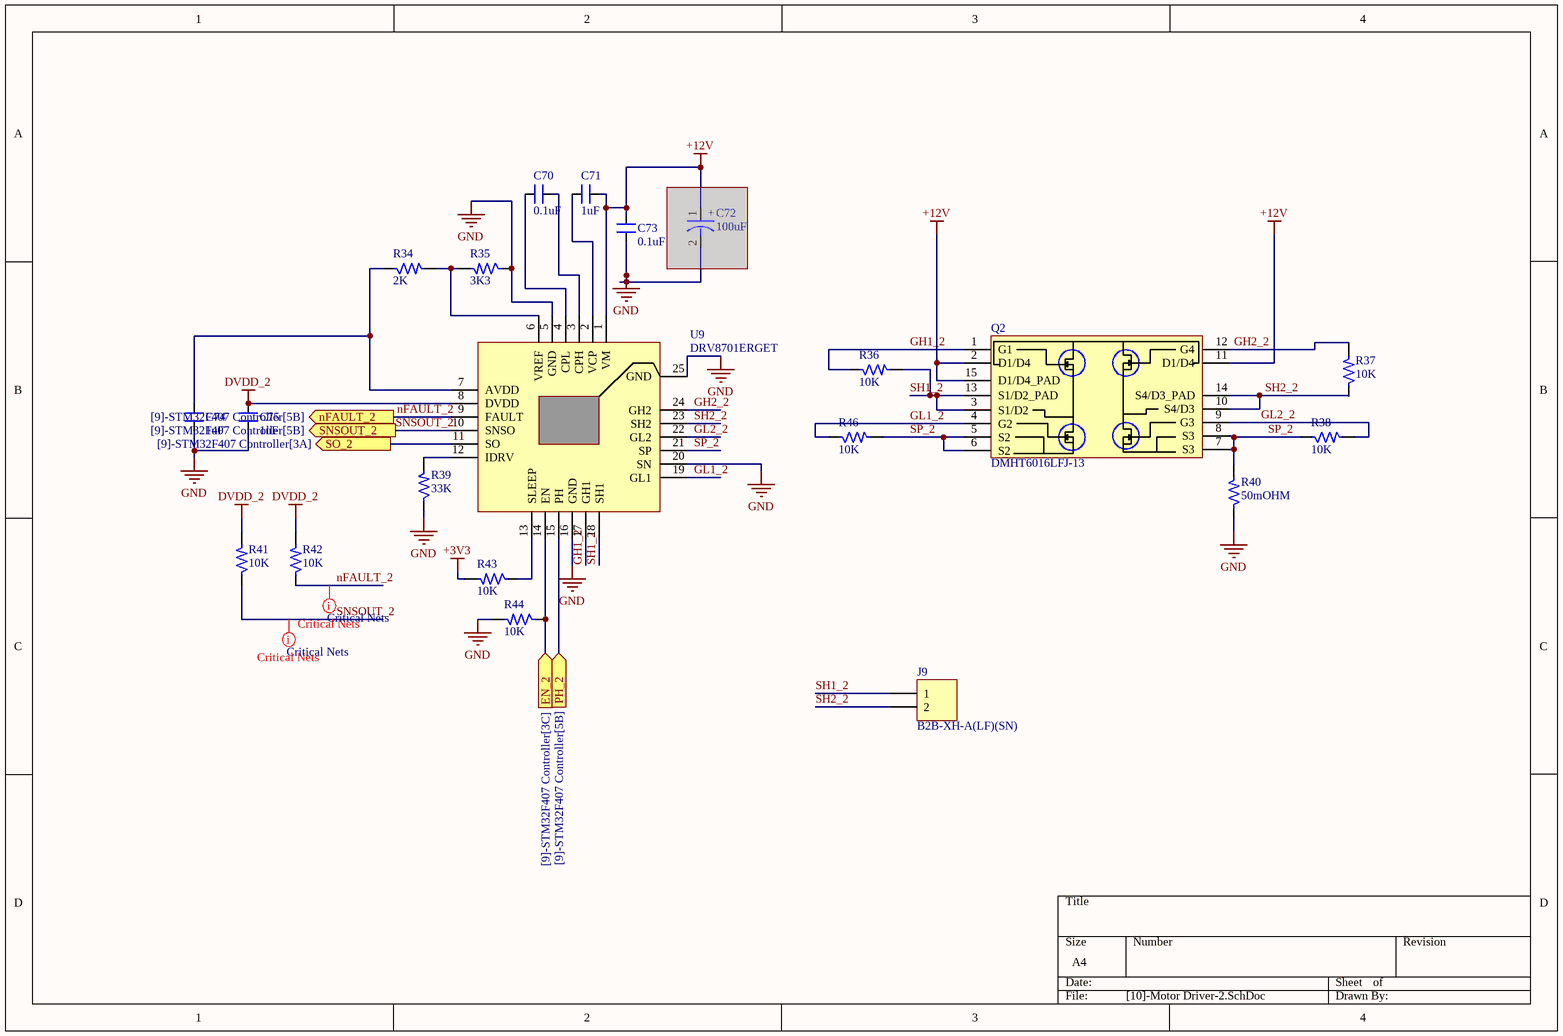
[diagram p9: [10]-Motor Driver-2.SchDoc]

### Parts
(Parts that share a designator on the sheet are numbered #1, #2 ... from top to bottom, then left to right.)
C70  0.1uF  [CAP_0805]
C71  1uF  [CAP_0805]
C72#2  100uF  [ACAP_P236_D305_H303_RAD]  (masked out: inside a compile mask, not in the netlist)
C73  0.1uF  [CAP_0805]
C74  1uF  [CAP_0805]
C75  1uF  [CAP_0805]
J9  B2B-XH-A(LF)(SN)  [CON2_100_B2B-XH-A_TH_ST]
Q2  DMHT6016LFJ-13  [DFN5045-12_33_212_27X15_SMD_1]
R34  2K  [RES_0603]
R35  3K3  [RES_0603]
R36  10K  [RES_0603]
R37  10K  [RES_0603]
R38  10K  [RES_0603]
R39  33K  [RES_0805]
R40  50mOHM  [RES_2512]
R41  10K  [RES_0603]
R42  10K  [RES_0603]
R43  10K  [RES_0603]
R44  10K  [RES_0603]
R46  10K  [RES_0603]
U9  DRV8701ERGET  [VFQFN24_19.6_196_12X32_SMD_1]

### Ports
EN_2 (in, see [9]-STM32F407 Controller[3C]), nFAULT_2 (out, see [9]-STM32F407 Controller[5B]), PH_2 (in, see [9]-STM32F407 Controller[5B]), SNSOUT_2 (out, see [9]-STM32F407 Controller[5B]), SO_2 (out, see [9]-STM32F407 Controller[3A])

### Nets
+3V3: R43.2
+12V: C71.2 C73.2 Q2.2(D1/D4) Q2.11(D1/D4) Q2.15(D1/D4_PAD) U9.1(VM)
DVDD_2: C75.2 R41.2 R42.2 U9.8(DVDD)
GND: C73.1 C74.1 C75.1 R35.1 R39.1 R40.1 R44.2 U9.5(GND) U9.16(GND) U9.20(SN) U9.25(GND)
EN_2: R44.1 U9.14(EN) ; port EN_2
GH1_2: Q2.1(G1) R36.1 U9.17(GH1)
GH2_2: Q2.12(G4) R37.2 U9.24(GH2)
GL1_2: Q2.4(G2) R46.1 U9.19(GL1)
GL2_2: Q2.9(G3) R38.2 U9.22(GL2)
nFAULT_2: R42.1 U9.9(FAULT) ; port nFAULT_2
PH_2: U9.15(PH) ; port PH_2
SH1_2: J9.1 Q2.3(S1/D2) Q2.13(S1/D2_PAD) R36.2 U9.18(SH1)
SH2_2: J9.2 Q2.10(S4/D3) Q2.14(S4/D3_PAD) R37.1 U9.23(SH2)
SNSOUT_2: R41.1 U9.10(SNSO) ; port SNSOUT_2
SO_2: U9.11(SO) ; port SO_2
SP_2: Q2.5(S2) Q2.6(S2) Q2.7(S3) Q2.8(S3) R38.1 R40.2 R46.2 U9.21(SP)
NetC70_1: C70.1 U9.3(CPH)
NetC70_2: C70.2 U9.4(CPL)
NetC71_1: C71.1 U9.2(VCP)
NetC74_2: C74.2 R34.1 U9.7(AVDD)
NetR34_2: R34.2 R35.2 U9.6(VREF)
NetR39_2: R39.2 U9.12(IDRV)
NetR43_1: R43.1 U9.13(SLEEP)

### Layout directives
net class Critical Nets: nFAULT_2, SNSOUT_2

### Notes on the sheet
- (in symbol CAP-P_100uF-25V-20%-RAD) +

### Library data of the parts
C70 C73 = CAP_0.1uF-50V-10%-0805: as C2 on sheet [3]- STM32F103 Debugger; Case/Package: 0805; Supplier-1: SIRICOM; Supplier Part Number-1: 0805B104K500CT
C71 C74 C75 = CAP_1uF-50V-5%-0805: as C7 on sheet [3]- STM32F103 Debugger; Case/Package: 0805; Supplier-1: SIRICOM; Supplier Part Number-1: CL21B105KBFNNNE
C72#2 = CAP-P_100uF-25V-20%-RAD: as C24 on sheet [5]- Motor Driver Schematic; Case/Package: Radial-SMD; Supplier-1: SP ROAD; Supplier Part Number-1: UWT1E101MCL1GS
J9 = CON-PLG_2X1-100-ST-TH: as ? on sheet [5]- Motor Driver Schematic; Manufacturer Part Number: B2B-XH-A(LF)(SN); Case/Package: TH-CON; Supplier-1: SP ROAD; Supplier Part Number-1: B2B-XH-A(LF)(SN)
Q2 = MOSFET-N_60V-14.8A-V-DFN5045-12: as Q1 on sheet [5]- Motor Driver Schematic; Manufacturer Part Number: DMHT6016LFJ-13; Case/Package: DFN5045-12; Supplier-1: LCSC; Supplier Part Number-1: C460986
R34 = RES_2K-0.125W-1%-0603: as R13 on sheet [5]- Motor Driver Schematic; Case/Package: 0603; Supplier-1: SIRICOM; Supplier Part Number-1: WR06X2001FTL
R35 = RES_3.3K-0.1W-1%-0603: as R5 on sheet [4]- Ethernet PHY; Case/Package: 0603; Supplier-1: SIRICOM; Supplier Part Number-1: WR06X3301FTL
R36-R38 R41-R44 R46 = RES_10K-0.1W-1%-0603: as R4 on sheet [3]- STM32F103 Debugger; Case/Package: 0603; Supplier-1: SIRICOM; Supplier Part Number-1: WR06X1002FTL
R39 = RES_33K-0.125W-1%-0805: as R18 on sheet [5]- Motor Driver Schematic; Case/Package: 0805; Supplier-1: SIRICOM; Supplier Part Number-1: WR08X3302FTL
R40 = RES_50mOhm-2W-1%-2512: as R19 on sheet [5]- Motor Driver Schematic; Case/Package: 2512; Supplier-1: SIRICOM; Supplier Part Number-1: LR2512-22R060F1
U9 = IC_DRV8701ERGET: as U3 on sheet [5]- Motor Driver Schematic; Manufacturer Part Number: DRV8701ERGET; Case/Package: VFQFN24; Supplier-1: ARROW; Supplier Part Number-1: DRV8701ERGET

## Sheet [11]- Power Input and Regulators.SchDoc
size A4; DocumentNumber: 11; SheetNumber: 11; SheetTotal: 11
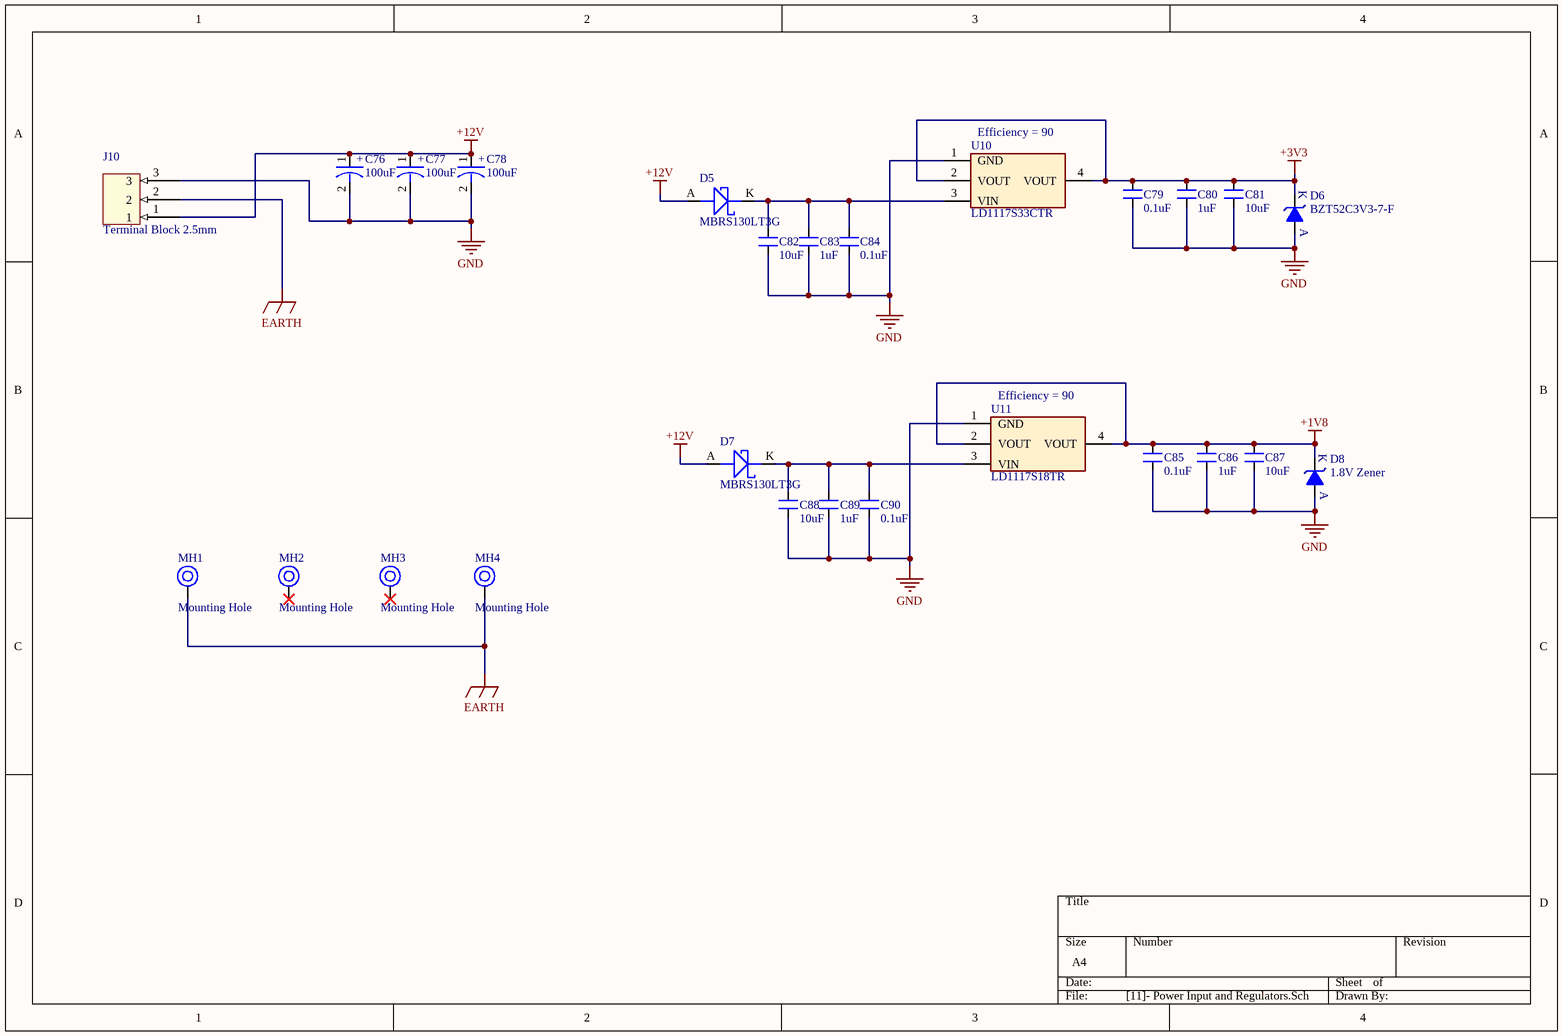
[diagram p10: [11]- Power Input and Regulators.SchDoc]

### Parts
C76  100uF  [ACAP_P305_D393_H393_RAD]
C77  100uF  [ACAP_P305_D393_H393_RAD]
C78  100uF  [ACAP_P305_D393_H393_RAD]
C79  0.1uF  [CAP_0805]
C80  1uF  [CAP_0805]
C81  10uF  [CAP_1206]
C82  10uF  [CAP_1206]
C83  1uF  [CAP_0805]
C84  0.1uF  [CAP_0805]
C85  0.1uF  [CAP_0805]
C86  1uF  [CAP_0805]
C87  10uF  [CAP_1206]
C88  10uF  [CAP_1206]
C89  1uF  [CAP_0805]
C90  0.1uF  [CAP_0805]
D5  MBRS130LT3G  [DIO_SMB_DO-214AA]
D6  BZT52C3V3-7-F  [DIO_SOD-123]
D7  MBRS130LT3G  [DIO_SMB_DO-214AA]
D8  1.8V Zener  [DIO_DO-213AB_SMD]
J10  Terminal Block 2.5mm  [CON3_100_TB_TH_ST]
MH1  Mounting Hole  [MOUNTING]
MH2  Mounting Hole  [MOUNTING]
MH3  Mounting Hole  [MOUNTING]
MH4  Mounting Hole  [MOUNTING]
U10  LD1117S33CTR  [SOT223_3]
U11  LD1117S18TR  [SOT223_3]

### Nets
+1V8: C85.2 C86.2 C87.2 D8.K U11.2(VOUT) U11.4(VOUT)
+3V3: C79.2 C80.2 C81.2 D6.K U10.2(VOUT) U10.4(VOUT)
+12V: C76.1 C77.1 C78.1 D5.A D7.A J10.1
EARTH: J10.2 MH1.1 MH4.1
GND: C76.2 C77.2 C78.2 C79.1 C80.1 C81.1 C82.1 C83.1 C84.1 C85.1 C86.1 C87.1 C88.1 C89.1 C90.1 D6.A D8.A J10.3 U10.1(GND) U11.1(GND)
NetC82_2: C82.2 C83.2 C84.2 D5.K U10.3(VIN)
NetC88_2: C88.2 C89.2 C90.2 D7.K U11.3(VIN)

Not connected (* = marked no-connect by the designer): MH2 1*; MH3 1*

### Notes on the sheet
- (near U10) Efficiency = 90
- (near U11) Efficiency = 90
- (in symbol CAP-P_100uF-50V-20%-RAD) +

### Library data of the parts
C76-C78 = CAP-P_100uF-50V-20%-RAD: 100µF 50V Aluminum Polymer Capacitor Radial, Can - SMD 28mOhm 4000 Hrs @ 125°C; Manufacturer: Nichicon; Manufacturer Part Number: GYA1H101MCQ1GS; Alternate Part Number-1: VEU101M1HTR-1010; Case/Package: Radial-SMD; Supplier-1: SP ROAD; Supplier Part Number-1: GYA1H101MCQ1GS
C79 C84 C85 C90 = CAP_0.1uF-50V-10%-0805: as C2 on sheet [3]- STM32F103 Debugger; Case/Package: 0805; Supplier-1: SIRICOM; Supplier Part Number-1: 0805B104K500CT
C80 C83 C86 C89 = CAP_1uF-50V-5%-0805: as C7 on sheet [3]- STM32F103 Debugger; Case/Package: 0805; Supplier-1: SIRICOM; Supplier Part Number-1: CL21B105KBFNNNE
C81 C82 C87 C88 = CAP_10uF-50V-10%-1206: as C11 on sheet [4]- Ethernet PHY; Case/Package: 1206; Supplier-1: SIRICOM; Supplier Part Number-1: CC1206KKX5R9BB106
D5 D7 = DIO-S_445mV-30V-2A-SMB: Diode Schottky 30V 2A Surface Mount SMB; Manufacturer: ON Semiconductor; Alternate Part Number-1: NA; Manufacturer Part Number: MBRS130LT3G; Case/Package: SMB; Supplier-1: ARROW; Supplier Part Number-1: MBRS130LT3G
D6 = DIO-Z_3.3V-500mW-SOD123: Zener Diode 3.3V 500mW ±6% Surface Mount SOD-123; Manufacturer: Diodes Incorporated; Alternate Part Number-1: NA; Manufacturer Part Number: BZT52C3V3-7-F; Case/Package: SOD-123; Supplier-1: Digikey; Supplier Part Number-1: BZT52C3V3-FDICT-ND
D8 = DIO-Z_1.8V-500mW-DO213AA: Zener Diode 1.8V 500mW ±5% Surface Mount DO-213AA; Manufacturer: *; Manufacturer Part Number: *; Case/Package: *; Supplier-1: *; Supplier Part Number-1: *; Alternate Part Number-1: *
J10 = CON-TB_3X1-100-ST-TH: 3 Pins, 1 Row 2.54mm Pitch, straight Connector, male; Manufacturer Part Number: 1725669; Manufacturer: Phoenix Contact; Alternate Part Number-1: NA; Case/Package: TH-CON; Supplier-1: SP ROAD; Supplier Part Number-1: 1725669
MH1-MH4 = MH_3.5H_6D: Manufacturer Part Number: NA; Case/Package: TH; Manufacturer: NA; Supplier-1: NA; Supplier Part Number-1: NA; Alternate Part Number-1: NA
U10 = REG_15V-3.3V-0.9A-12W-SOT223: Linear Voltage Regulator IC 1 Output 800mA SOT-223; Manufacturer: STMicroelectronics; Alternate Part Number-1: NA; Manufacturer Part Number: LD1117S33CTR; Case/Package: SOT223; Supplier-1: SP ROAD; Supplier Part Number-1: LD1117S33CTR
U11 = REG_15V-1.8V-0.8A-1.4W-SOT223: LDO Voltage Regulators 1.8V 0.8A Positive; Manufacturer: STMicroelectronics; Alternate Part Number-1: NA; Manufacturer Part Number: LD1117S18TR; Case/Package: SOT-223-3; Supplier-1: Mouser; Supplier Part Number-1: 511-LD1117S18-TR